# Altium project DAQ_REV_B2.PrjPcb (part 1 of 2)
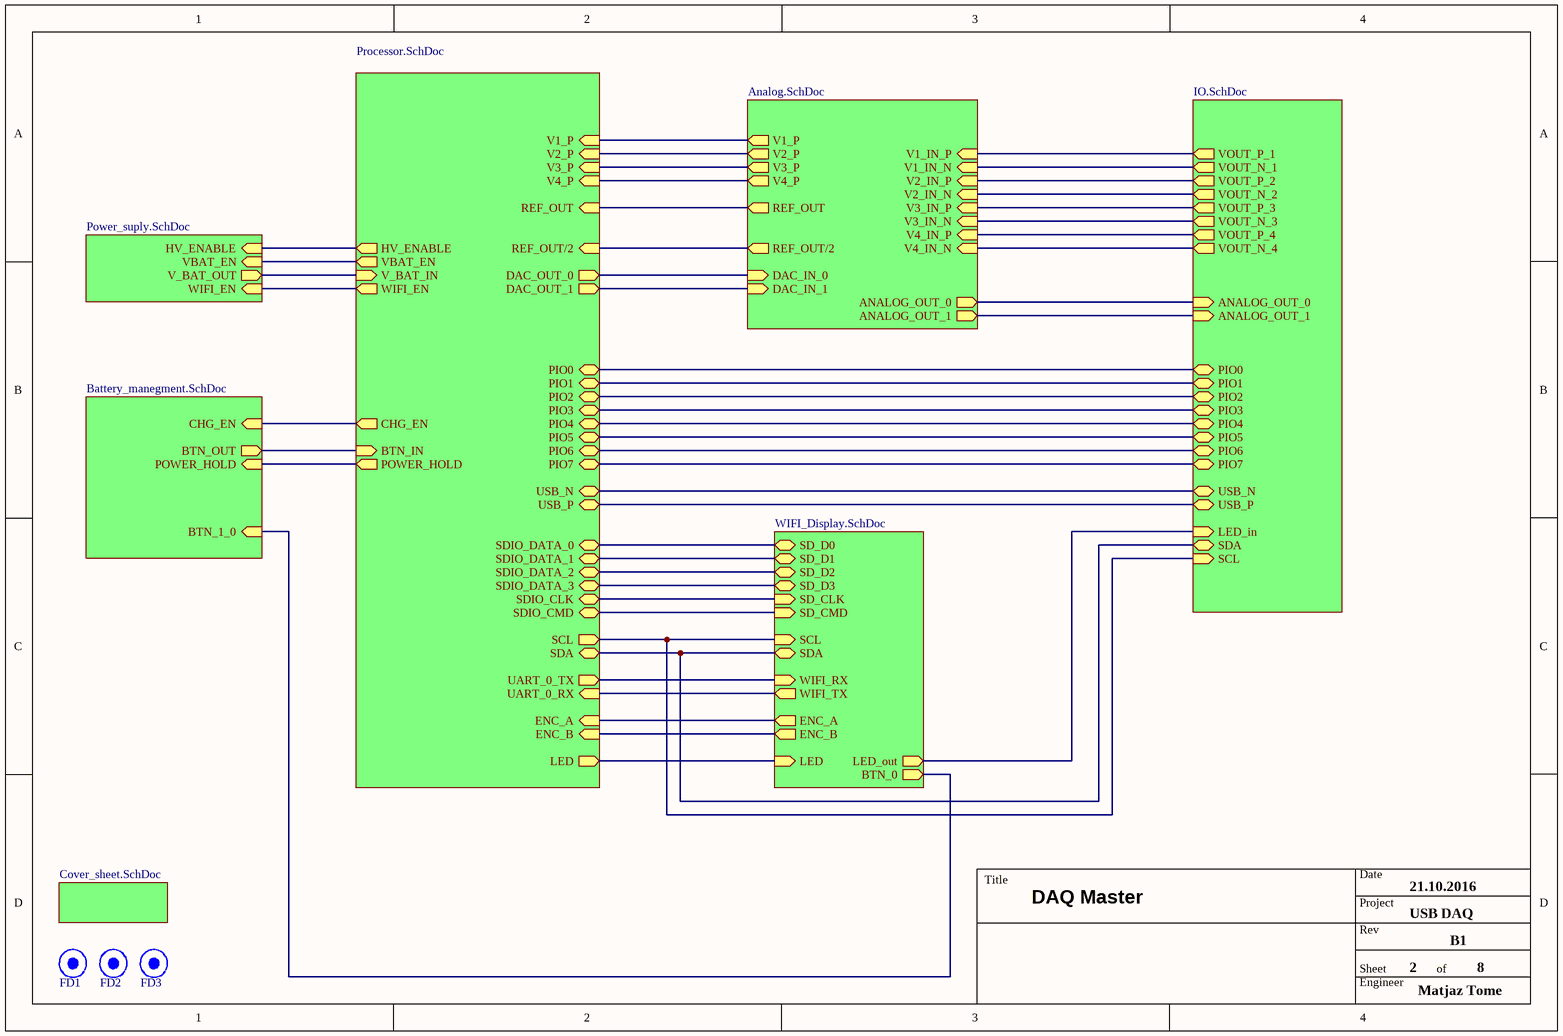
[diagram p0: DAQ.SchDoc]
ProjectEngineer: Matjaz Tome; ProjectName: DAQ; ProjectRev: B
8 sheets, 191 parts. Net scope: hierarchical (ports join the sheet entries above them; power ports are global).
Board file: DAQ_REV_B2.PcbDoc
Sheets:
  DAQ.SchDoc
     = Processor.SchDoc
     = Analog.SchDoc
     = IO.SchDoc
     = Power_suply.SchDoc
     = Battery_manegment.SchDoc
     = WIFI_Display.SchDoc
     = Cover_sheet.SchDoc

## Sheet DAQ.SchDoc: DAQ Master
size A4; Date: 21.10.2016; Engineer: Matjaz Tome; DocumentNumber: 2; Revision: B1; SheetNumber: 2; SheetTotal: 8; Project: USB DAQ

### Parts
FD1  Fiducial 1mm  [FID1]  (value not drawn)  (no BOM)
FD2  Fiducial 1mm  [FID1]  (value not drawn)  (no BOM)
FD3  Fiducial 1mm  [FID1]  (value not drawn)  (no BOM)

### Sub-sheets
? = Processor.SchDoc: PIO0 (bidir), PIO1 (bidir), PIO2 (bidir), PIO3 (bidir), PIO4 (bidir), PIO5 (bidir), PIO6 (bidir), PIO7 (bidir), V3_P (in), V4_P (in), V1_P (in), V2_P (in), USB_N (bidir), USB_P (bidir), DAC_OUT_0 (out), DAC_OUT_1 (out), REF_OUT/2 (in), REF_OUT (in), HV_ENABLE (out), SDIO_DATA_0 (bidir), SDIO_DATA_1 (bidir), SDIO_DATA_2 (bidir), SDIO_DATA_3 (bidir), SDIO_CLK (bidir), SDIO_CMD (bidir), UART_0_TX (out), UART_0_RX (in), SCL (out), SDA (bidir), POWER_HOLD (out), V_BAT_IN (in), ENC_A (in), ENC_B (in), WIFI_EN (out), VBAT_EN (out), BTN_IN (in), LED (out), CHG_EN (out)
? = Analog.SchDoc: V1_IN_P (in), V1_IN_N (in), V2_IN_N (in), V3_IN_N (in), V4_IN_N (in), V4_IN_P (in), V3_IN_P (in), V2_IN_P (in), REF_OUT/2 (out), DAC_IN_0 (in), DAC_IN_1 (in), ANALOG_OUT_0 (out), ANALOG_OUT_1 (out), V1_P (out), V2_P (out), V3_P (out), V4_P (out), REF_OUT (out)
? = IO.SchDoc: PIO0 (bidir), PIO1 (bidir), PIO2 (bidir), PIO3 (bidir), PIO4 (bidir), PIO5 (bidir), PIO6 (bidir), PIO7 (bidir), VOUT_N_1 (out), VOUT_N_2 (out), VOUT_N_3 (out), VOUT_N_4 (out), VOUT_P_1 (out), VOUT_P_2 (out), VOUT_P_3 (out), VOUT_P_4 (out), ANALOG_OUT_0 (in), ANALOG_OUT_1 (in), USB_N (bidir), USB_P (bidir), SDA (bidir), SCL (in), LED_in (in)
? = Power_suply.SchDoc: HV_ENABLE (in), VBAT_EN (in), V_BAT_OUT (out), WIFI_EN (in)
? = Battery_manegment.SchDoc: BTN_OUT (out), POWER_HOLD (in), BTN_1_0 (in), CHG_EN (in)
? = WIFI_Display.SchDoc: SD_CLK (in), ENC_B (out), BTN_0 (out), WIFI_RX (in), ENC_A (out), SD_D2 (bidir), SD_D3 (bidir), SDA (bidir), SCL (in), SD_D1 (bidir), WIFI_TX (out), SD_D0 (bidir), SD_CMD (in), LED (in), LED_out (out)
? = Cover_sheet.SchDoc: no entries

### Nets
ANALOG_OUT_0: sheet /ANALOG_OUT_0, sheet /ANALOG_OUT_0
ANALOG_OUT_1: sheet /ANALOG_OUT_1, sheet /ANALOG_OUT_1
BTN_0: sheet /BTN_1_0, sheet /BTN_0
BTN_IN: sheet /BTN_IN, sheet /BTN_OUT
CHG_EN: sheet /CHG_EN, sheet /CHG_EN
DAC_OUT_0: sheet /DAC_OUT_0, sheet /DAC_IN_0
DAC_OUT_1: sheet /DAC_OUT_1, sheet /DAC_IN_1
ENC_A: sheet /ENC_A, sheet /ENC_A
ENC_B: sheet /ENC_B, sheet /ENC_B
HV_ENABLE: sheet /HV_ENABLE, sheet /HV_ENABLE
JTAG_TDO: sheet /LED, sheet /LED
LED_in: sheet /LED_in, sheet /LED_out
PIO0: sheet /PIO0, sheet /PIO0
PIO1: sheet /PIO1, sheet /PIO1
PIO2: sheet /PIO2, sheet /PIO2
PIO3: sheet /PIO3, sheet /PIO3
PIO4: sheet /PIO4, sheet /PIO4
PIO5: sheet /PIO5, sheet /PIO5
PIO6: sheet /PIO6, sheet /PIO6
PIO7: sheet /PIO7, sheet /PIO7
POWER_HOLD: sheet /POWER_HOLD, sheet /POWER_HOLD
REF_OUT: sheet /REF_OUT, sheet /REF_OUT
REF_OUT/2: sheet /REF_OUT/2, sheet /REF_OUT/2
SCL: sheet /SCL, sheet /SCL, sheet /SCL
SD_CLK: sheet /SDIO_CLK, sheet /SD_CLK
SD_CMD: sheet /SDIO_CMD, sheet /SD_CMD
SD_D0: sheet /SDIO_DATA_0, sheet /SD_D0
SD_D1: sheet /SDIO_DATA_1, sheet /SD_D1
SD_D2: sheet /SDIO_DATA_2, sheet /SD_D2
SD_D3: sheet /SDIO_DATA_3, sheet /SD_D3
SDA: sheet /SDA, sheet /SDA, sheet /SDA
UART_0_RX: sheet /UART_0_RX, sheet /WIFI_TX
UART_0_TX: sheet /UART_0_TX, sheet /WIFI_RX
USB_N: sheet /USB_N, sheet /USB_N
USB_P: sheet /USB_P, sheet /USB_P
V1_IN_N: sheet /V1_IN_N, sheet /VOUT_N_1
V1_IN_P: sheet /V1_IN_P, sheet /VOUT_P_1
V1_P: sheet /V1_P, sheet /V1_P
V2_IN_N: sheet /V2_IN_N, sheet /VOUT_N_2
V2_IN_P: sheet /V2_IN_P, sheet /VOUT_P_2
V2_P: sheet /V2_P, sheet /V2_P
V3_IN_N: sheet /V3_IN_N, sheet /VOUT_N_3
V3_IN_P: sheet /V3_IN_P, sheet /VOUT_P_3
V3_P: sheet /V3_P, sheet /V3_P
V4_IN_N: sheet /V4_IN_N, sheet /VOUT_N_4
V4_IN_P: sheet /V4_IN_P, sheet /VOUT_P_4
V4_P: sheet /V4_P, sheet /V4_P
V_BAT_IN: sheet /V_BAT_IN, sheet /V_BAT_OUT
VBAT_EN: sheet /VBAT_EN, sheet /VBAT_EN
WIFI_EN: sheet /WIFI_EN, sheet /WIFI_EN

### Notes on the sheet
- Title
- Date
- Project
- Rev
- Engineer
- Sheet
- of

### Library data of the parts
FD1-FD3 = XXC0016: Part Number: XXC0016; Category: Fiducials

## Sheet Processor.SchDoc: Processor + JTAG
size A4; Date: 23.10.2016; Engineer: Matjaz Tome; DocumentNumber: 5; Revision: B1; SheetNumber: 5; SheetTotal: 8; Project: USB DAQ
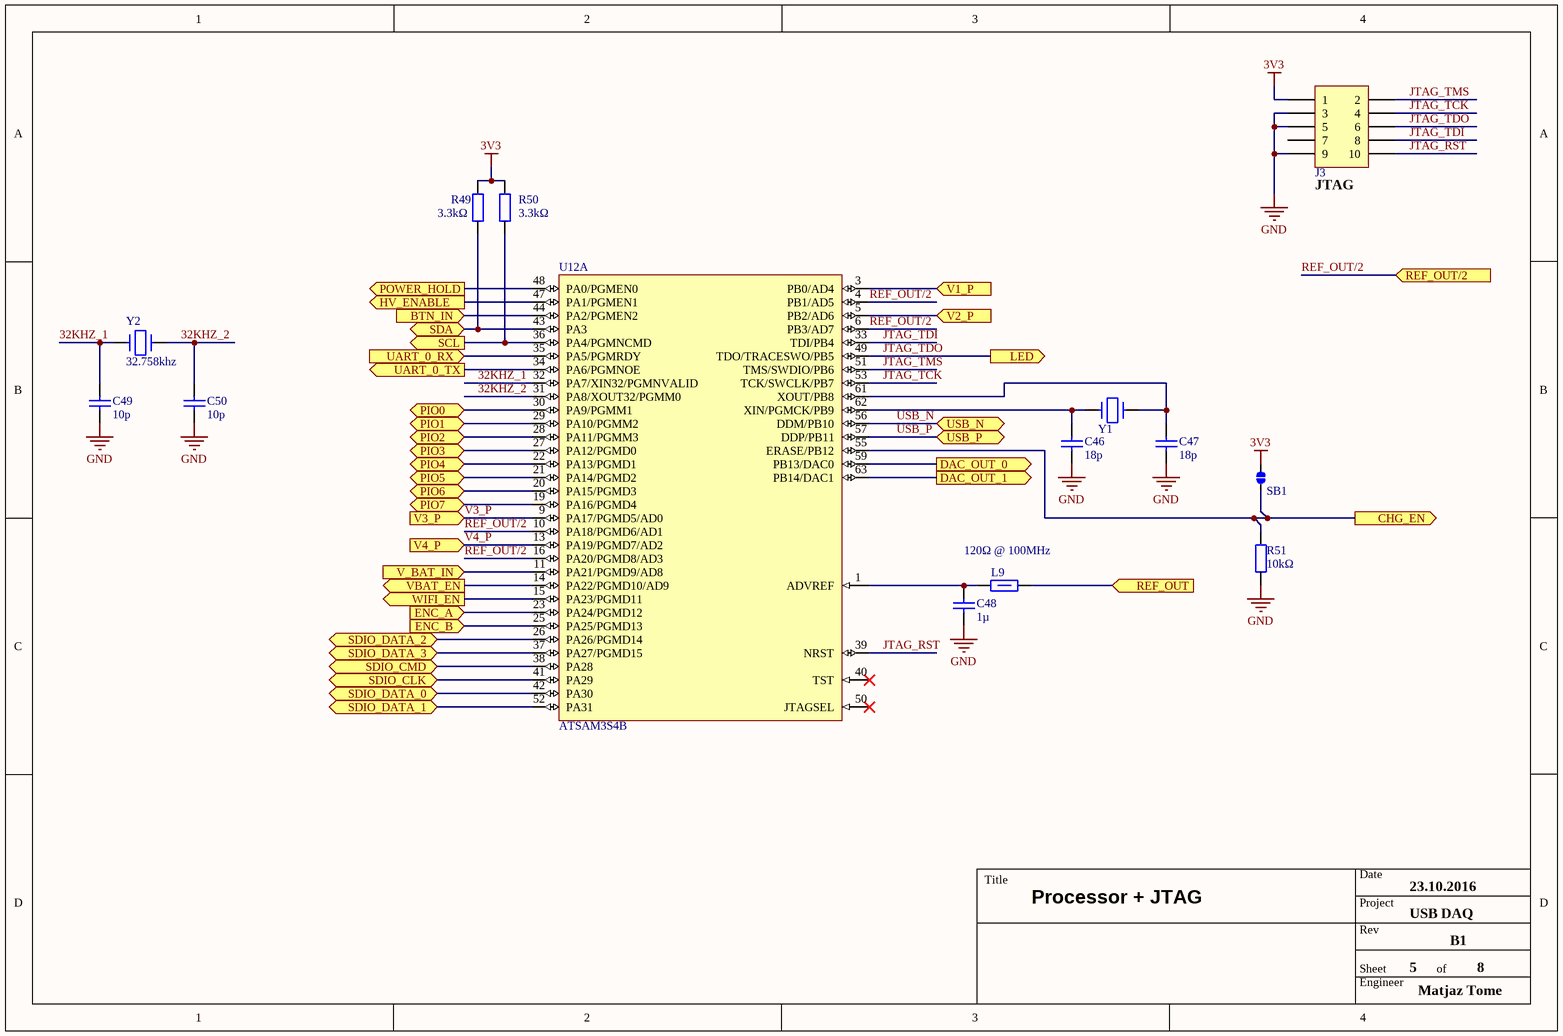
[diagram p1: Processor.SchDoc]

### Parts
C46  18p  [0603C]
C47  18p  [0603C]
C48  1µ  [0603C]
C49  10p  [0603C]
C50  10p  [0603C]
J3  (no value)  [HEADER_2X05_1.27mm]
L9  120Ω @ 100MHz  [0805R]
R49  3.3kΩ  [0603R]
R50  3.3kΩ  [0603R]
R51  10kΩ  [0603R]
SB1  Solder bridge  [SB1]  (value not drawn)  (no BOM)
U12  ATSAM3S4B  [LQFP64]  (part A of 2)
Y1  16MHz  [5X3.2]  (value not drawn)
Y2  32.758khz  [2X6_FLAT]

### Ports
BTN_IN (in), CHG_EN (out), DAC_OUT_0 (out), DAC_OUT_1 (out), ENC_A (in), ENC_B (in), HV_ENABLE (out), LED (out), PIO0 (bidir), PIO1 (bidir), PIO2 (bidir), PIO3 (bidir), PIO4 (bidir), PIO5 (bidir), PIO6 (bidir), PIO7 (bidir), POWER_HOLD (out), REF_OUT (in), REF_OUT/2 (in), SCL (out), SDA (bidir), SDIO_CLK (bidir), SDIO_CMD (bidir), SDIO_DATA_0 (bidir), SDIO_DATA_1 (bidir), SDIO_DATA_2 (bidir), SDIO_DATA_3 (bidir), UART_0_RX (in), UART_0_TX (out), USB_N (bidir), USB_P (bidir), V1_P (in), V2_P (in), V3_P (in), V4_P (in), V_BAT_IN (in), VBAT_EN (out), WIFI_EN (out)

### Nets
3V3: J3.1 R49.2 R50.2 SB1.2
GND: C46.1 C47.1 C48.1 C49.1 C50.1 J3.3 J3.5 J3.9 R51.1
32KHZ_1: C49.2 U12.32(PA7/XIN32/PGMNVALID) Y2.2
32KHZ_2: C50.2 U12.31(PA8/XOUT32/PGMM0) Y2.1
BTN_IN: U12.44(PA2/PGMEN2) ; port BTN_IN
CHG_EN: R51.2 SB1.1 U12.55(ERASE/PB12) ; port CHG_EN
DAC_OUT_0: U12.59(PB13/DAC0) ; port DAC_OUT_0
DAC_OUT_1: U12.63(PB14/DAC1) ; port DAC_OUT_1
ENC_A: U12.23(PA24/PGMD12) ; port ENC_A
ENC_B: U12.25(PA25/PGMD13) ; port ENC_B
HV_ENABLE: U12.47(PA1/PGMEN1) ; port HV_ENABLE
JTAG_RST: J3.10 U12.39(NRST)
JTAG_TCK: J3.4 U12.53(TCK/SWCLK/PB7)
JTAG_TDI: J3.8 U12.33(TDI/PB4)
JTAG_TDO: J3.6 U12.49(TDO/TRACESWO/PB5) ; port LED
JTAG_TMS: J3.2 U12.51(TMS/SWDIO/PB6)
PIO0: U12.30(PA9/PGMM1) ; port PIO0
PIO1: U12.29(PA10/PGMM2) ; port PIO1
PIO2: U12.28(PA11/PGMM3) ; port PIO2
PIO3: U12.27(PA12/PGMD0) ; port PIO3
PIO4: U12.22(PA13/PGMD1) ; port PIO4
PIO5: U12.21(PA14/PGMD2) ; port PIO5
PIO6: U12.20(PA15/PGMD3) ; port PIO6
PIO7: U12.19(PA16/PGMD4) ; port PIO7
POWER_HOLD: U12.48(PA0/PGMEN0) ; port POWER_HOLD
REF_OUT: L9.2 ; port REF_OUT
REF_OUT/2: U12.4(PB1/AD5) U12.6(PB3/AD7) U12.10(PA18/PGMD6/AD1) U12.16(PA20/PGMD8/AD3) ; port REF_OUT/2
SCL: R50.1 U12.36(PA4/PGMNCMD) ; port SCL
SD_CLK: U12.41(PA29) ; port SDIO_CLK
SD_CMD: U12.38(PA28) ; port SDIO_CMD
SD_D0: U12.42(PA30) ; port SDIO_DATA_0
SD_D1: U12.52(PA31) ; port SDIO_DATA_1
SD_D2: U12.26(PA26/PGMD14) ; port SDIO_DATA_2
SD_D3: U12.37(PA27/PGMD15) ; port SDIO_DATA_3
SDA: R49.1 U12.43(PA3) ; port SDA
UART_0_RX: U12.35(PA5/PGMRDY) ; port UART_0_RX
UART_0_TX: U12.34(PA6/PGMNOE) ; port UART_0_TX
USB_N: U12.56(DDM/PB10) ; port USB_N
USB_P: U12.57(DDP/PB11) ; port USB_P
V1_P: U12.3(PB0/AD4) ; port V1_P
V2_P: U12.5(PB2/AD6) ; port V2_P
V3_P: U12.9(PA17/PGMD5/AD0) ; port V3_P
V4_P: U12.13(PA19/PGMD7/AD2) ; port V4_P
V_BAT_IN: U12.11(PA21/PGMD9/AD8) ; port V_BAT_IN
VBAT_EN: U12.14(PA22/PGMD10/AD9) ; port VBAT_EN
WIFI_EN: U12.15(PA23/PGMD11) ; port WIFI_EN
NetC46_2: C46.2 U12.62(XIN/PGMCK/PB9) Y1.1
NetC47_2: C47.2 U12.61(XOUT/PB8) Y1.2
NetC48_2: C48.2 L9.1 U12.1(ADVREF)

Not connected (* = marked no-connect by the designer): J3 7; U12 40(TST)* 50(JTAGSEL)*

### Notes on the sheet
- (near J3) JTAG
- Title
- Date
- Project
- Rev
- Engineer
- Sheet
- of

### Library data of the parts
C46 C47 = GSC0017: ceramic C0G SMD capacitor smd 0603 18pF 100V; Manufacturer: Kemet; Manufacturer Number: C0603C180J1GACTU; Dealer number: 1813428; Dealer: Farnell; Tolerance: 5%; Part Number: GSC0017; Category: capacitors; Price: 0.15; Value: 18pF; Voltage: 100V; Case: 0603; Technology: SMT; Dielectric: C0G; HelpURL: U:\datasheet\cap\KEMET C0G SMD.pdf; SKU: 1020000000003; Supplier 1: Farnell; Supplier part number 1: 1813428
C48 = ZSC0003: ceramic X5R SMD capacitor smd 0603 1µF 50V; Manufacturer: Murata; Manufacturer Number: GRM188R61H105KAALD; Tolerance: 10%; Part Number: ZSC0003; Category: capacitors; Price: 0.144; Value: 1µF; Voltage: 50V; Case: 0603; Technology: SMT; Dielectric: X5R; HelpURL: U:\datasheet\cap\Murata\GRM\GRM188R61H105KAALD.pdf; SKU: 1020300000001; Supplier part number 1: 1845736; Supplier 1: Farnell
C49 C50 = GSC0019: ceramic C0G SMD capacitor smd 0603 10pF 100V; Manufacturer: Kemet; Manufacturer Number: C0603C100J1GACTU; Dealer number: 1414600; Dealer: Farnell; Tolerance: 5%; Part Number: GSC0019; Category: capacitors; Price: 0.038; Value: 10pF; Voltage: 100V; Case: 0603; Technology: SMT; Dielectric: C0G; HelpURL: U:\datasheet\cap\KEMET C0G SMD.pdf; SKU: 1020000000004; Supplier 1: Farnell; Supplier part number 1: 1414600
J3 = XCH0006: Header strait 1.27mm 5way X 2; Manufacturer: Harwin; Manufacturer Number: M50-3600542; Gender: Male; Rows: 2; Part Number: XCH0006; Category: Connectors; Price: 0.90; Pins: 5; Pitch: 1.27mm; Orientation: strait; Technology: SMD; Supplier part number 1: 1022310; Supplier 1: Farnell
L9 = XFB0000: Ferrite bead, 0.15Ω, 200mA, 0805, 120E @ 100MHz; Manufacturer: Murata; Manufacturer Number: BLM21AG121SN1D; Dealer number: 1515617; Dealer: Farnell; Max current: 0.2A; Part Number: XFB0000; Category: ferite beads; Price: 0.082; DC resistance: 0.15Ω; AC resistance: 120Ω; Frequency: 100MHz; Case: 0805; Technology: SMT; HelpURL: U:\datasheet\ferrite_beads\BLM21A.pdf; Supplier 1: Farnell; Supplier part number 1: 1515617
R49 R50 = XRS0055: resistor smd 0603 3.3kΩ 5% 0.1w; Manufacturer: Yageo; Manufacturer Number: RC0603JR-073K3L; Temperature coefficient: 100ppm; Part Number: XRS0055; Category: resistors; Supplier part number 1: 9233440; Supplier 1: Farnell; Price: 0.0118; Value: 3.3kΩ; Power: 0.1W; Tolerance: 5%; Case: 0603; Technology: SMT; Material: Metal film / Metal film; HelpURL: U:\datasheet\res\YAGEO_2.pdf
R51 = YRS0016: resistor smd 0603 10kΩ 1% 0.1w; Manufacturer: Vishay; Manufacturer Number: CRCW060310K0FKEA; Dealer number: 1469748; Dealer: Farnell; Temperature coefficient: 100ppm; Part Number: YRS0016; Category: resistors; Price: 0.0143€; Value: 10kΩ; Power: 0.1W; Tolerance: 1%; Case: 0603; Technology: SMT; Material: Metal film - thick / Metal film; HelpURL: U:\datasheet\res\VISHAY CRCW0603.pdf; SKU: 1000000000002; Supplier 1: Farnell; Supplier part number 1: 1469748
SB1 = XXC0005: Solder bridge 1mm by 2mm; Part Number: XXC0005; Category: Solder bridge
U12 = XAM0003: Cortex M3 ARM microcontroller; Manufacturer: Atmel; Manufacturer Number: ATSAM3S4BA-AU; Dealer number: 1841656; Dealer: Farnell; Core: Cortex-M3; Supply voltage max: 3.6V; Supply voltage min: 1.62V; Flash: 256kB; RAM: 48kB; GPIOs: 47; Timers: 3; ADCs: 8; SPI: 1; IIC: 2; Max Frequency: 64MHz; Part Number: XAM0003; Category: Integrated circuits; Price: 6.58; UART: 3; Case: LQFP64; Technology: SMT; HelpURL: U:\datasheet\microcontrollers\arm\SAM3SXA.pdf; Temperature range: -40°C to +85°C; Supplier 1: Farnell; Supplier part number 1: 1841656
Y1 = XCR0007: Crystal 16Mhz; Manufacturer: TCX; Manufacturer Number: 7A-16.000MAAJ-T; Load capacitance: 18pF; Frequency tolerance: 30ppm; Part Number: XCR0007; Category: Crystals; Price: 0.91; Value: 16MHz; Technology: SMT; Case: 5X3.2; HelpURL: U:\datasheet\crystals\TXC_7A.pdf; Supplier part number 1: 1841946; Supplier 1: Farnell
Y2 = XCR0010: Crystal 32.768khz; Manufacturer: RALTRON; Manufacturer Number: R26-32.768- 12.5; Load capacitance: 12pF; Frequency tolerance: 20ppm; Part Number: XCR0010; Category: Crystals; Price: 0.18; Value: 32.758khz; Technology: THT; Case: 5X3.2_1; HelpURL: U:\datasheet\crystals\raltron.pdf; Supplier part number 1: 1652573; Supplier 1: Farnell

## Sheet Analog.SchDoc: Level shifters + Amplifiers
size A4; Date: 6.4.2015; Engineer: Matjaz Tome; DocumentNumber: 6; Revision: B1; SheetNumber: 6; SheetTotal: 8; Project: USB DAQ
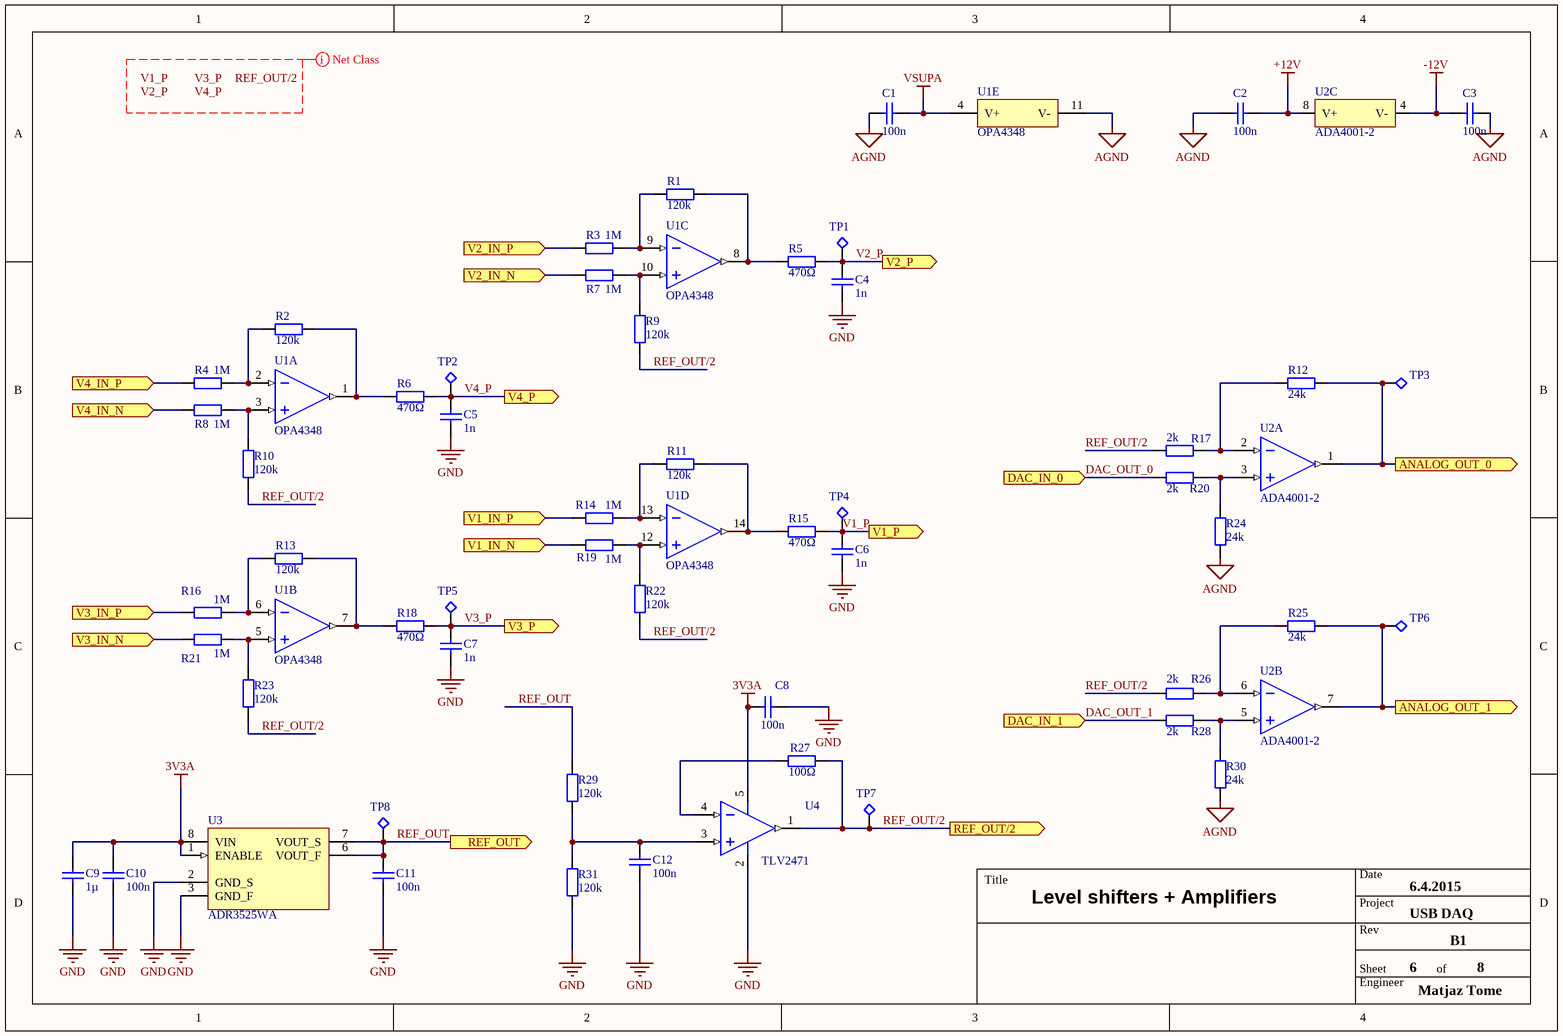
[diagram p2: Analog.SchDoc]

### Parts
C1  100n  [0603C]
C2  100n  [0603C]
C3  100n  [0603C]
C4  1n  [0603C]
C5  1n  [0603C]
C6  1n  [0603C]
C7  1n  [0603C]
C8  100n  [0603C]
C9  1µ  [0603C]
C10  100n  [0603C]
C11  100n  [0603C]
C12  100n  [0603C]
R1  120k  [0603R]
R2  120k  [0603R]
R3  1M  [0603R]
R4  1M  [0603R]
R5  470Ω  [0603R]
R6  470Ω  [0603R]
R7  1M  [0603R]
R8  1M  [0603R]
R9  120k  [0603R]
R10  120k  [0603R]
R11  120k  [0603R]
R12  24k  [0603R]
R13  120k  [0603R]
R14  1M  [0603R]
R15  470Ω  [0603R]
R16  1M  [0603R]
R17  2k  [0603R]
R18  470Ω  [0603R]
R19  1M  [0603R]
R20  2k  [0603R]
R21  1M  [0603R]
R22  120k  [0603R]
R23  120k  [0603R]
R24  24k  [0603R]
R25  24k  [0603R]
R26  2k  [0603R]
R27  100Ω  [0603R]
R28  2k  [0603R]
R29  120k  [0603R]
R30  24k  [0603R]
R31  120k  [0603R]
TP1  testpoint  [TP1_FULL]  (value not drawn)  (no BOM)
TP2  testpoint  [TP1_FULL]  (value not drawn)  (no BOM)
TP3  testpoint  [TP1_FULL]  (value not drawn)  (no BOM)
TP4  testpoint  [TP1_FULL]  (value not drawn)  (no BOM)
TP5  testpoint  [TP1_FULL]  (value not drawn)  (no BOM)
TP6  testpoint  [TP1_FULL]  (value not drawn)  (no BOM)
TP7  testpoint  [TP1_FULL]  (value not drawn)  (no BOM)
TP8  testpoint  [TP1_FULL]  (value not drawn)  (no BOM)
U1  OPA4348  [SOIC14]  (parts A,B,C,D,E of 5)
U2  ADA4001-2  [SOIC8]  (parts A,B,C of 3)
U3  ADR3525WA  [MSOP8]
U4  TLV2471  [SOT23-5]

### Ports
ANALOG_OUT_0 (out), ANALOG_OUT_1 (out), DAC_IN_0 (in), DAC_IN_1 (in), REF_OUT (out), REF_OUT/2 (out), V1_IN_N (in), V1_IN_P (in), V1_P (out), V2_IN_N (in), V2_IN_P (in), V2_P (out), V3_IN_N (in), V3_IN_P (in), V3_P (out), V4_IN_N (in), V4_IN_P (in), V4_P (out)

### Nets
3V3A: C8.2 C9.2 C10.2 U3.1(ENABLE) U3.8(VIN) U4.5(V+)
+12V: C2.1 U2.8(V+)
-12V: C3.2 U2.4(V-)
AGND: C1.2 C2.2 C3.1 R24.1 R30.1 U1.11(V-)
GND: C4.1 C5.1 C6.1 C7.1 C8.1 C9.1 C10.1 C11.1 C12.1 R31.1 U3.2(GND_S) U3.3(GND_F) U4.2(V-)
VSUPA: C1.1 U1.4(V+)
ANALOG_OUT_0: R12.2 TP3.1 U2.1(OUT) ; port ANALOG_OUT_0
ANALOG_OUT_1: R25.1 TP6.1 U2.7(OUT) ; port ANALOG_OUT_1
DAC_OUT_0: R20.1 ; port DAC_IN_0
DAC_OUT_1: R28.1 ; port DAC_IN_1
REF_OUT: C11.2 R29.2 TP8.1 U3.6(VOUT_F) U3.7(VOUT_S) ; port REF_OUT
REF_OUT/2: R9.1 R10.1 R17.1 R22.1 R23.1 R26.1 R27.2 TP7.1 U4.1(OUT_A) ; port REF_OUT/2
V1_IN_N: R19.1 ; port V1_IN_N
V1_IN_P: R14.1 ; port V1_IN_P
V1_P: C6.2 R15.2 TP4.1 ; port V1_P
V2_IN_N: R7.1 ; port V2_IN_N
V2_IN_P: R3.1 ; port V2_IN_P
V2_P: C4.2 R5.2 TP1.1 ; port V2_P
V3_IN_N: R21.1 ; port V3_IN_N
V3_IN_P: R16.1 ; port V3_IN_P
V3_P: C7.2 R18.2 TP5.1 ; port V3_P
V4_IN_N: R8.1 ; port V4_IN_N
V4_IN_P: R4.1 ; port V4_IN_P
V4_P: C5.2 R6.2 TP2.1 ; port V4_P
NetC12_2: C12.2 R29.1 R31.2 U4.3(+IN_A)
NetR1_1: R1.1 R3.2 U1.9(-IN_C)
NetR1_2: R1.2 R5.1 U1.8(OUT_C)
NetR2_1: R2.1 R4.2 U1.2(-IN_A)
NetR2_2: R2.2 R6.1 U1.1(OUT_A)
NetR7_2: R7.2 R9.2 U1.10(+IN_C)
NetR8_2: R8.2 R10.2 U1.3(+IN_A)
NetR11_1: R11.1 R14.2 U1.13(-IN_D)
NetR11_2: R11.2 R15.1 U1.14(OUT_D)
NetR12_1: R12.1 R17.2 U2.2(IN-)
NetR13_1: R13.1 R16.2 U1.6(-IN_B)
NetR13_2: R13.2 R18.1 U1.7(OUT_B)
NetR19_2: R19.2 R22.2 U1.12(+IN_D)
NetR20_2: R20.2 R24.2 U2.3(IN+)
NetR21_2: R21.2 R23.2 U1.5(+IN_B)
NetR25_2: R25.2 R26.2 U2.6(IN2-)
NetR27_1: R27.1 U4.4(-IN_A)
NetR28_2: R28.2 R30.2 U2.5(IN2+)

### Layout directives
net class ANALOG: REF_OUT/2, V1_P, V2_P, V3_P, V4_P

### Notes on the sheet
- Labels drawn without touching a wire or pin: REF_OUT/2, V1_P, V2_P, V3_P, V4_P
- Title
- Date
- Project
- Rev
- Engineer
- Sheet
- of

### Library data of the parts
C1-C3 C8 C10-C12 = RSC0013: ceramic X7R SMD capacitor smd 0603 100nF 16V; Manufacturer: Murata; Manufacturer Number: GRM188R71C104KA01D; Dealer number: 1828890; Dealer: Farnell; Tolerance: 10%; Part Number: RSC0013; Category: capacitors; Price: 0.042; Value: 100nF; Voltage: 16V; Case: 0603; Technology: SMT; Dielectric: X7R; HelpURL: U:\datasheet\cap\Murata\GRM\GRM188R71C104KA01D.pdf; Supplier 1: Farnell; Supplier Part Number 1: 1828890
C4-C7 = RSC0016: ceramic X7R SMD capacitor smd 0603 1nF 100V; Manufacturer: Kemet; Manufacturer Number: C0603C102K1RACTU; Dealer number: 1414606; Dealer: Farnell; Tolerance: 10%; Part Number: RSC0016; Category: capacitors; Price: 0.039; Value: 1nF; Voltage: 100V; Case: 0603; Technology: SMT; Dielectric: X7R; HelpURL: U:\datasheet\cap\KEMET X7R SMD.pdf; Supplier 1: Farnell; Supplier Part Number 1: 1414606; SKU: 1020100000013
C9 = ZSC0003: as C48 on sheet Processor; Part Number: ZSC0003; Category: capacitors; Price: 0.144; Value: 1µF; Voltage: 50V; Case: 0603; Technology: SMT; Dielectric: X5R; HelpURL: U:\datasheet\cap\Murata\GRM\GRM188R61H105KAALD.pdf; SKU: 1020300000001; Supplier part number 1: 1845736; Supplier 1: Farnell
R1 R2 R9-R11 R13 R22 R23 R29 R31 = ZRS0007: resistor smd 0603 120kΩ 0.1% 0.1w; Manufacturer: Panasonic; Manufacturer Number: ERA3AEB124V; Temperature coefficient: 25ppm; Part Number: ZRS0007; Category: resistors; Price: 0.26; Value: 120KΩ; Power: 0.1W; Tolerance: 0.1%; Case: 0603; Technology: SMT; Material: Metal film - thin / Metal film; HelpURL: U:\datasheet\res\PANASONIC_ERA.pdf; Supplier part number 1: 1577634; Supplier 1: Farnell
R3 R4 R7 R8 R14 R16 R19 R21 = ZRS0005: resistor smd 0603 1MΩ 0.1% 0.1w; Manufacturer: TE Connectivity; Manufacturer Number: CPF0603B1M0E1; Temperature coefficient: 25ppm; Part Number: ZRS0005; Category: resistors; Price: 0.36; Value: 1MΩ; Power: 0.1W; Tolerance: 0.1%; Case: 0603; Technology: SMT; Material: Metal film - thin / Metal film; HelpURL: U:\datasheet\res\TE_CONNECTIVITY_CPF.pdf; Supplier part number 1: 2331023; Supplier 1: Farnell
R5 R6 R15 R18 = XRS0039: resistor smd 0603 470Ω 5% 0.1w; Manufacturer: Multicomp; Manufacturer Number: MCMR06X471 JTL; Temperature coefficient: 100ppm; Part Number: XRS0039; Category: resistors; Price: 0.009€; Value: 470Ω; Power: 0.1W; Tolerance: 5%; Case: 0603; Technology: SMT; Material: Metal film / Metal film; HelpURL: U:\datasheet\res\MULTICOMP 0603.pdf; Supplier part number 1: 2073513; Supplier 1: Farnell
R12 R24 R25 R30 = ZRS0008: resistor smd 0603 24kΩ 0.1% 0.1w; Manufacturer: Welwyn; Manufacturer Number: PCF0603P-R-24K-BT1; Temperature coefficient: 25ppm; Part Number: ZRS0008; Category: resistors; Price: 0.194; Value: 24KΩ; Power: 0.1W; Tolerance: 0.1%; Case: 0603; Technology: SMT; Material: Metal film - thin / Metal film; HelpURL: U:\datasheet\res\WELW.pdf; Supplier part number 1: 1506034; Supplier 1: Farnell
R17 R20 R26 R28 = ZRS0001: resistor smd 0603 2kΩ 0.1% 0.1w; Manufacturer: Susumu; Manufacturer Number: RR0816P-202-B-T5; Temperature coefficient: 25ppm; Part Number: ZRS0001; Category: resistors; Price: 0.098; Value: 2KΩ; Power: 0.1W; Tolerance: 0.1%; Case: 0603; Technology: SMT; Material: Metal film - thin / Metal film; HelpURL: U:\datasheet\res\SUSUMU_RR.pdf; Supplier part number 1: 1653263; Supplier 1: Farnell
R27 = XRS0016: resistor smd 0603 100Ω 5% 0.1w; Manufacturer: Multicomp; Manufacturer Number: MCMR06X101 JTL; Temperature coefficient: 100ppm; Part Number: XRS0016; Category: resistors; Price: 0.009€; Value: 100Ω; Power: 0.1W; Tolerance: 5%; Case: 0603; Technology: SMT; Material: Metal film / Metal film; HelpURL: U:\datasheet\res\MULTICOMP 0603.pdf; Supplier part number 1: 2073352; Supplier 1: Farnell
TP1-TP8 = XXC0006: testpoint 1.5mm diameter no hole; Part Number: XXC0006; Category: testpoints
U1 = XOG0008: 1MHz, 45µA, CMOS, Rail-to-Rail OPERATIONAL AMPLIFIERS Value Line Series; Manufacturer: Texas Instruments; Manufacturer Number: OPA4348AID; Supply voltage max: 5.5V; Supply voltage min: 2.1V; Devices: 4; Rail to Rail: IN/OUT; Part Number: XOG0008; Category: Integrated circuits; Price: 1.64; GBP: 1MHz; Case: SOIC14; Technology: SMT; HelpURL: U:\datasheet\opamps\OPA348.pdf; Supplier part number 1: 2323277; Supplier 1: Farnell
U2 = XOG0003: Low Noise, Low Input Bias Current, Rail-to-Rail / Output, JFET Dual Operational Amplifier; Manufacturer: Analog devices; Manufacturer Number: ADA4001-2ARZ; Supply voltage max: 36V; Devices: 2; GBP: 16.7MHz; Slew rate: 25V/µs; Rail to Rail: IN/OUT; Part Number: XOG0003; Category: Integrated circuits; Price: 2.8; Case: SOIC8; Technology: SMT; HelpURL: U:\datasheet\opamps\ADA4001-2.pdf; Supplier part number 1: 2081044; Supplier 1: Farnell
U3 = VRX0002: Micropower, High Accuracy / Voltage References; Manufacturer: Analog devices; Manufacturer Number: ADR3525WARMZ-R7; Dealer number: 2077701; Dealer: Farnell; Output Voltage: 2.5V; Max input voltage: 5.5V; Output current: 10mA; Voltage tolerance: 0.1%; Part Number: VRX0002; Category: Integrated circuits; Price: 1.66; Case: MSOP8; Technology: SMT; HelpURL: U:\datasheet\volage_references\ADR35XX.pdf; Supplier 1: Farnell; Supplier part number 1: 2077701
U4 = XOG0002: FAMILY OF 600μA/Ch 2.8MHz RAIL-TO-RAIL INPUT/OUTPUT / HIGH-DRIVE OPERATIONAL AMPLIFIERS WITH SHUTDOWN; Manufacturer: Texas Instruments; Manufacturer Number: TLV2471IDBVT; Supply voltage max: 6V; Supply voltage min: 2.7V; Devices: 1; Rail to Rail: IN/OUT; Part Number: XOG0002; Category: Integrated circuits; Price: 1.43; GBP: 2.8MHz; Case: SOT23-5; Technology: SMT; HelpURL: U:\datasheet\opamps\TLV247x.pdf; Supplier part number 1: 1102964; Supplier 1: Farnell

## Sheet IO.SchDoc: Digital I/O + ESD
size A4; Date: 23.10.2016; Engineer: Matjaz Tome; DocumentNumber: 8; Revision: B1; SheetNumber: 8; SheetTotal: 8; Project: USB DAQ
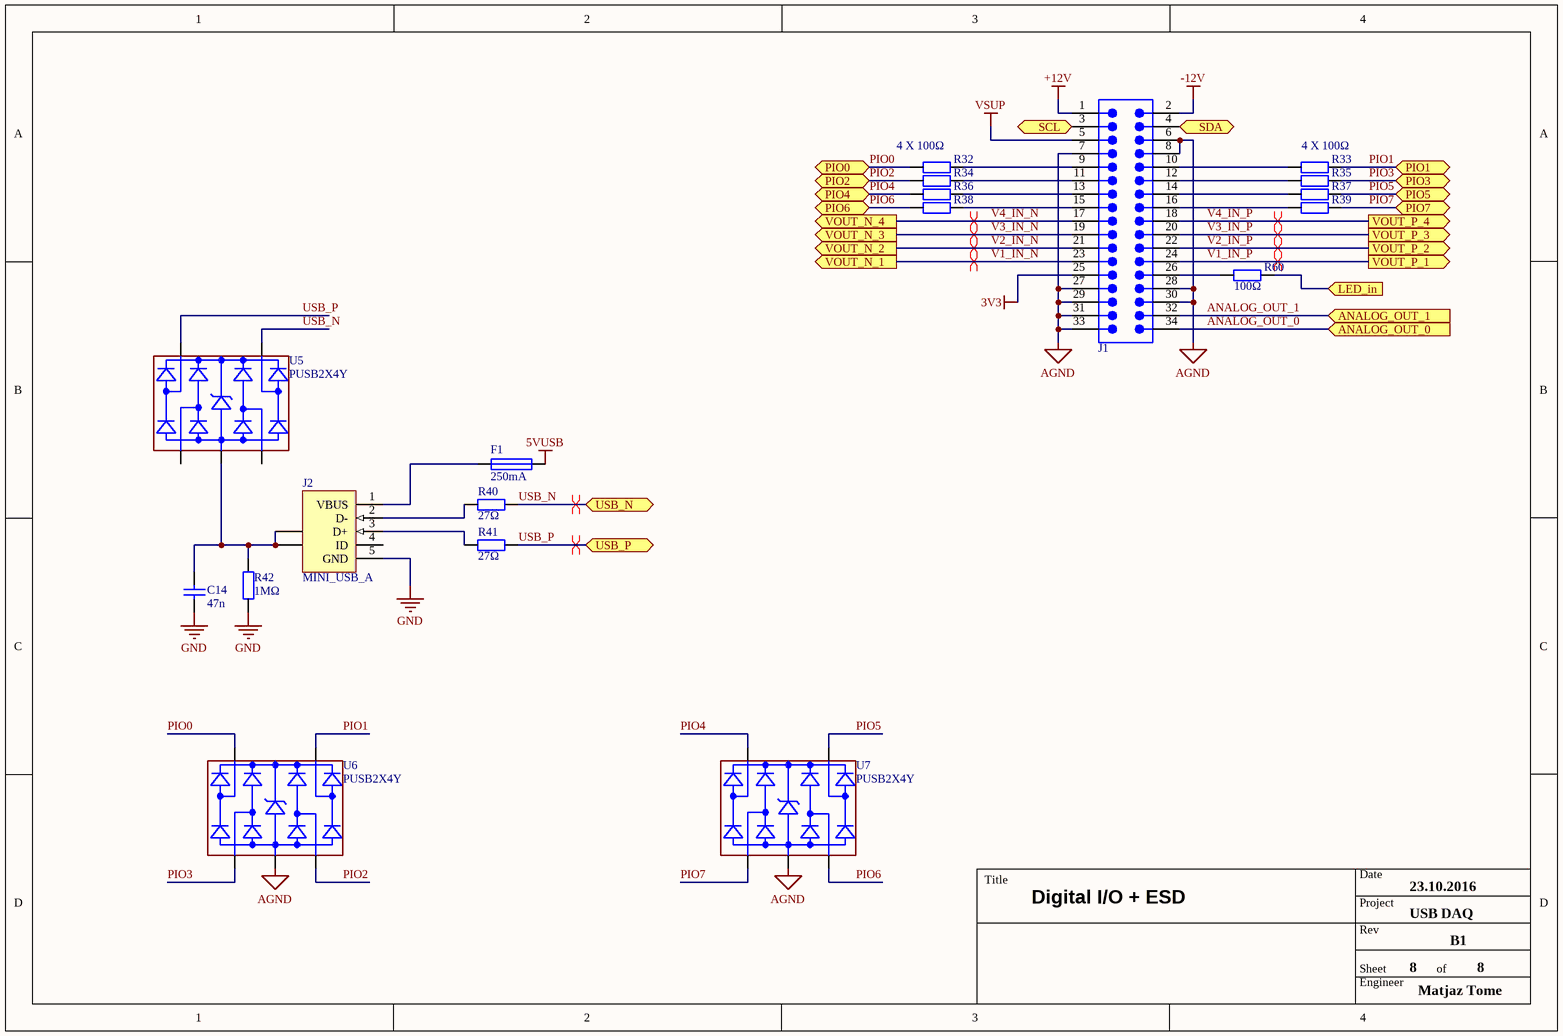
[diagram p3: IO.SchDoc]

### Parts
C14  47n  [0603C]
F1  250mA  [1206]
J1  IDC34R  [IDC34R]  (value not drawn)
J2  MINI_USB_A  [MICRO_USB_A]
R32  100Ω  [0603R]  (value not drawn)
R33  100Ω  [0603R]  (value not drawn)
R34  100Ω  [0603R]  (value not drawn)
R35  100Ω  [0603R]  (value not drawn)
R36  100Ω  [0603R]  (value not drawn)
R37  100Ω  [0603R]  (value not drawn)
R38  100Ω  [0603R]  (value not drawn)
R39  100Ω  [0603R]  (value not drawn)
R40  27Ω  [0603R]
R41  27Ω  [0603R]
R42  1MΩ  [0603R]
R60  100Ω  [0603R]
U5  PUSB2X4Y  [SOT363]
U6  PUSB2X4Y  [SOT363]
U7  PUSB2X4Y  [SOT363]

### Ports
ANALOG_OUT_0 (in), ANALOG_OUT_1 (in), LED_in (in), PIO0 (bidir), PIO1 (bidir), PIO2 (bidir), PIO3 (bidir), PIO4 (bidir), PIO5 (bidir), PIO6 (bidir), PIO7 (bidir), SCL (in), SDA (bidir), USB_N (bidir), USB_P (bidir), VOUT_N_1 (out), VOUT_N_2 (out), VOUT_N_3 (out), VOUT_N_4 (out), VOUT_P_1 (out), VOUT_P_2 (out), VOUT_P_3 (out), VOUT_P_4 (out)

### Nets
3V3: J1.25
5VUSB: F1.2
+12V: J1.1
-12V: J1.2
AGND: J1.6 J1.7 J1.8 J1.27 J1.28 J1.29 J1.30 J1.31 J1.33 U6.2 U7.2
GND: C14.1 J2.5(GND) R42.1
VSUP: J1.5
ANALOG_OUT_0: J1.34 ; port ANALOG_OUT_0
ANALOG_OUT_1: J1.32 ; port ANALOG_OUT_1
LED_in: R60.2 ; port LED_in
PIO0: R32.1 U6.6 ; port PIO0
PIO1: R33.2 U6.4 ; port PIO1
PIO2: R34.1 U6.3 ; port PIO2
PIO3: R35.2 U6.1 ; port PIO3
PIO4: R36.1 U7.6 ; port PIO4
PIO5: R37.2 U7.4 ; port PIO5
PIO6: R38.1 U7.3 ; port PIO6
PIO7: R39.2 U7.1 ; port PIO7
SCL: J1.3 ; port SCL
SDA: J1.4 ; port SDA
USB_N: R40.2 U5.4 ; port USB_N
USB_P: R41.2 U5.6 ; port USB_P
V1_IN_N: J1.23 ; port VOUT_N_1
V1_IN_P: J1.24 ; port VOUT_P_1
V2_IN_N: J1.21 ; port VOUT_N_2
V2_IN_P: J1.22 ; port VOUT_P_2
V3_IN_N: J1.19 ; port VOUT_N_3
V3_IN_P: J1.20 ; port VOUT_P_3
V4_IN_N: J1.17 ; port VOUT_N_4
V4_IN_P: J1.18 ; port VOUT_P_4
NetC14_2: C14.2 J2.6(SHLD) J2.7(SHLD) R42.2 U5.2
NetF1_1: F1.1 J2.1(VBUS)
NetJ1_9: J1.9 R32.2
NetJ1_10: J1.10 R33.1
NetJ1_11: J1.11 R34.2
NetJ1_12: J1.12 R35.1
NetJ1_13: J1.13 R36.2
NetJ1_14: J1.14 R37.1
NetJ1_15: J1.15 R38.2
NetJ1_16: J1.16 R39.1
NetJ1_26: J1.26 R60.1
NetJ2_2: J2.2(D-) R40.1
NetJ2_3: J2.3(D+) R41.1

Not connected (* = marked no-connect by the designer): J2 4(ID); U5 1 3

### Layout directives
differential pair: USB_N, USB_P, V1_IN_N, V1_IN_P, V2_IN_N, V2_IN_P, V3_IN_N, V3_IN_P, V4_IN_N, V4_IN_P

### Notes on the sheet
- (near R32) 4 X 100Ω
- (near R33) 4 X 100Ω
- Title
- Date
- Project
- Rev
- Engineer
- Sheet
- of

### Library data of the parts
C14 = RSC0007: ceramic X7R SMD capacitor smd 0603 47nF 16V; Manufacturer: Multicomp; Manufacturer Number: MC0603B473K160CT; Dealer number: 1759011; Dealer: Farnell; Tolerance: 10%; Part Number: RSC0007; Category: capacitors; Price: 0.009; Value: 47nF; Voltage: 16V; Case: 0603; Technology: SMT; Dielectric: X7R; HelpURL: U:\datasheet\cap\MULTICOMP_2.pdf; Supplier 1: Farnell; Supplier Part Number 1: 1759011
F1 = XXF0001: Polyfuse 250 mA holding current, 500 mA trip current; Manufacturer: Littelfuse; Manufacturer Number: 1206L025YR / 2920L030DR; Dealer number: 1596990; Dealer: Farnell; Trip current: 500mA; Max voltage: 16V; Resistance: 2.3Ω; Part Number: XXF0001; Category: Fuses; Price: 0.46; Type: Poly fuse; Holing current: 250mA; Technology: SMT; HelpURL: U:\datasheet\fuses\litefuse1.pdf; Supplier 1: Farnell; Supplier part number 1: 1596990
J1 = CHI0002: Harting IDC connector 2X17; Manufacturer Number: 09 18 534 7323; Pitch: 2.54mm; Lenght: 2.9mm; Strain Reliefe: no; Part Number: CHI0002; Category: Connectors; Price: 2.26; Manufacturer: Harting; Pins: 34; Orientation: right angle; Technology: THT; Supplier part number 1: 1106736; Supplier 1: Farnell
J2 = XCU0003: CONNECTOR, MICRO USB B, SMD, 5WAY; Manufacturer: FCI; Manufacturer Number: 10104111-0001LF; Gender: Receptacle; Part Number: XCU0003; Category: Connectors; Price: 0.37; Type: A; Size: micro; Technology: SMT / SMT; HelpURL: U:\datasheet\usb_con\FCI2_micro.pdf; Supplier part number 1: 2293755; Supplier 1: Farnell
R32-R39 R60 = XRS0016: as R27 on sheet Analog; Part Number: XRS0016; Category: resistors; Price: 0.009€; Value: 100Ω; Power: 0.1W; Tolerance: 5%; Case: 0603; Technology: SMT; Material: Metal film / Metal film; HelpURL: U:\datasheet\res\MULTICOMP 0603.pdf; Supplier part number 1: 2073352; Supplier 1: Farnell
R40 R41 = XRS0033: resistor smd 0603 27Ω 5% 0.1w; Manufacturer: Panasonic; Manufacturer Number: ERJ3GEYJ270V; Temperature coefficient: 200ppm; Part Number: XRS0033; Category: resistors; Price: 0.009€; Value: 27Ω; Power: 0.1W; Tolerance: 5%; Case: 0603; Technology: SMT; Material: Metal film - thick / Metal film - thick; HelpURL: U:\datasheet\res\PANASONIC.pdf; Supplier part number 1: 2059559; Supplier 1: Farnell
R42 = XRS0035: resistor smd 0603 1MΩ 5% 0.1w; Manufacturer: Multicomp; Manufacturer Number: MCMR06X105 JTL; Temperature coefficient: 100ppm; Part Number: XRS0035; Category: resistors; Price: 0.009€; Value: 1MΩ; Power: 0.1W; Tolerance: 5%; Case: 0603; Technology: SMT; Material: Metal film / Metal film; HelpURL: U:\datasheet\res\MULTICOMP 0603.pdf; SKU: 1000100000012; Supplier part number 1: 2073358; Supplier 1: Farnell
U5-U7 = XDE0000: ESD protection for high-speed interfaces; Manufacturer: Multicomp; Clamping voltage: 3.8V; Part Number: XDE0000; Category: diode array; Price: 0.174; Manufacturer Number: PUSB2X4Y; Case: SOT363; Technology: SMT; HelpURL: U:\datasheet\diodes_esd\PUSB2X4Y.pdf; Supplier part number 1: 2400968; Supplier 1: Farnell

## Sheet Power_suply.SchDoc: Power suply
size A4; Date: 6.4.2015; Engineer: Matjaz Tome; DocumentNumber: 4; Revision: B1; SheetNumber: 4; SheetTotal: 8; Project: USB DAQ
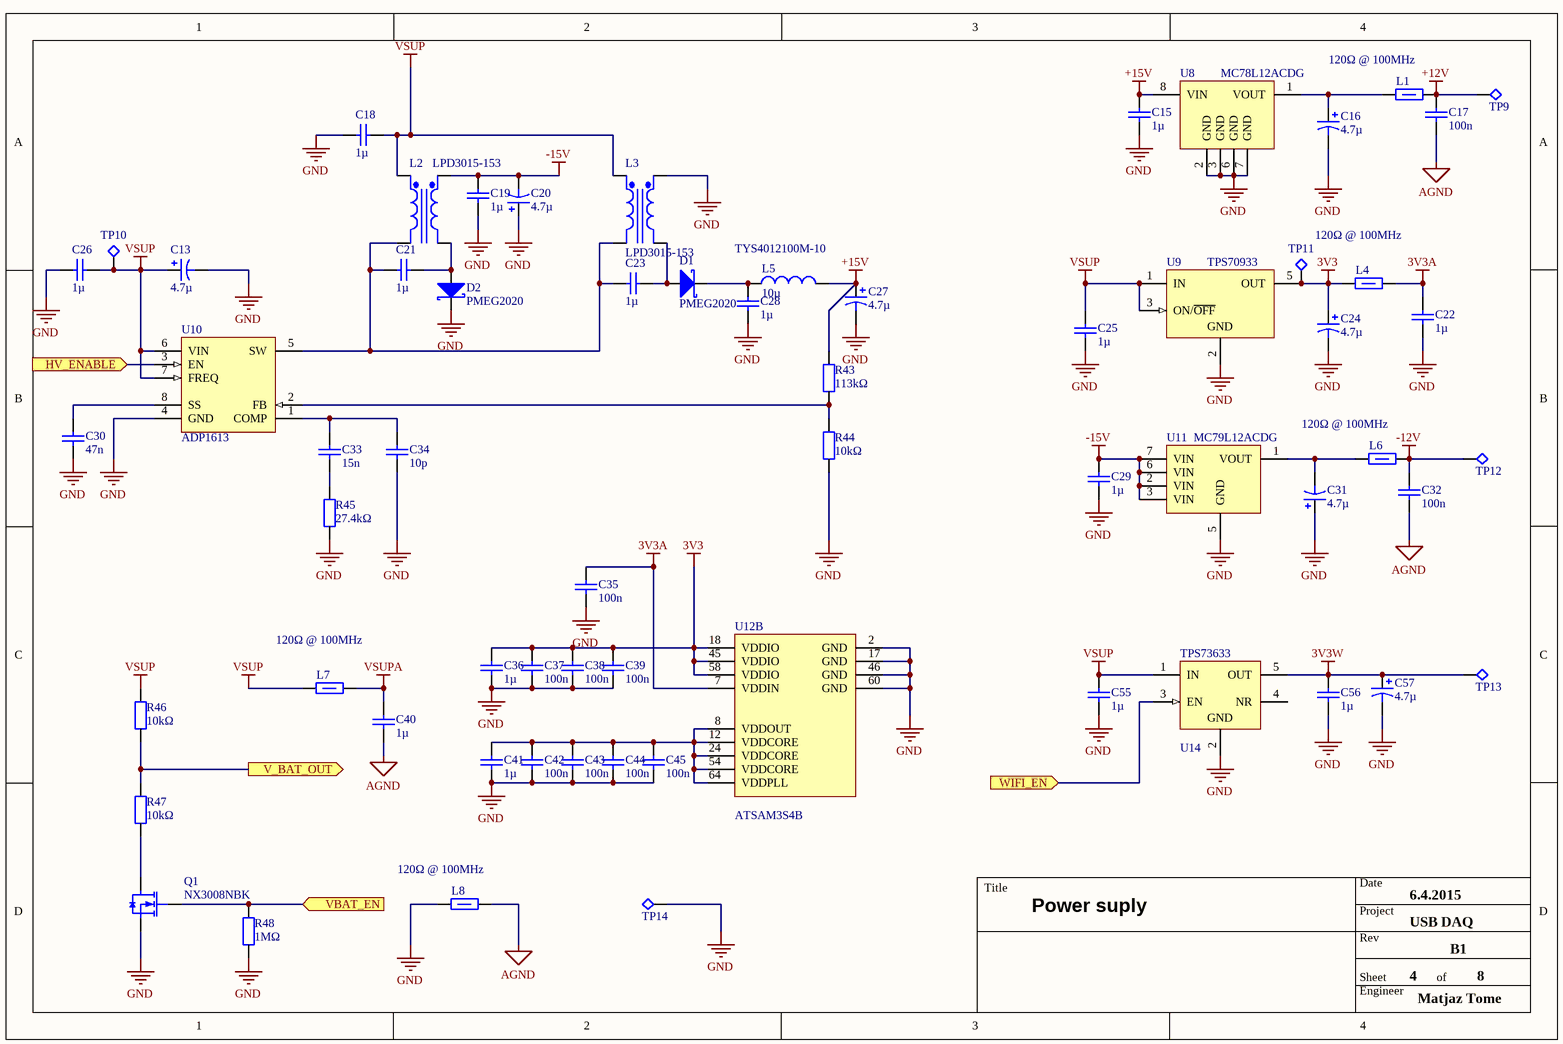
[diagram p4: Power_suply.SchDoc]

### Parts
C13  4.7µ  [A]
C15  1µ  [0603C]
C16  4.7µ  [A]
C17  100n  [0603C]
C18  1µ  [0603C]
C19  1µ  [0603C]
C20  4.7µ  [A]
C21  1µ  [0603C]
C22  1µ  [0603C]
C23  1µ  [0603C]
C24  4.7µ  [A]
C25  1µ  [0603C]
C26  1µ  [0603C]
C27  4.7µ  [A]
C28  1µ  [0603C]
C29  1µ  [0603C]
C30  47n  [0603C]
C31  4.7µ  [A]
C32  100n  [0603C]
C33  15n  [0603C]
C34  10p  [0603C]
C35  100n  [0603C]
C36  1µ  [0603C]
C37  100n  [0603C]
C38  100n  [0603C]
C39  100n  [0603C]
C40  1µ  [0603C]
C41  1µ  [0603C]
C42  100n  [0603C]
C43  100n  [0603C]
C44  100n  [0603C]
C45  100n  [0603C]
C55  1µ  [0603C]
C56  1µ  [0603C]
C57  4.7µ  [A]
D1  PMEG2020  [SOD323]
D2  PMEG2020  [SOD323]
L1  120Ω @ 100MHz  [0805R]
L2  LPD3015-153  [LPD3015]
L3  LPD3015-153  [LPD3015]
L4  120Ω @ 100MHz  [0805R]
L5  10µ  Manufacturer Number: TYS4012100M-10  [ind_4mmX4mm]
L6  120Ω @ 100MHz  [0805R]
L7  120Ω @ 100MHz  [0805R]
L8  120Ω @ 100MHz  [0805R]
Q1  NX3008NBK  [SOT23-3]
R43  113kΩ  [0603R]
R44  10kΩ  [0603R]
R45  27.4kΩ  [0603R]
R46  10kΩ  [0603R]
R47  10kΩ  [0603R]
R48  1MΩ  [0603R]
TP9  testpoint  [TP1_FULL]  (value not drawn)  (no BOM)
TP10  testpoint  [TP1_FULL]  (value not drawn)  (no BOM)
TP11  testpoint  [TP1_FULL]  (value not drawn)  (no BOM)
TP12  testpoint  [TP1_FULL]  (value not drawn)  (no BOM)
TP13  testpoint  [TP1_FULL]  (value not drawn)  (no BOM)
TP14  testpoint  [TP1_FULL]  (value not drawn)  (no BOM)
U8  MC78L12ACDG  [SOIC8]
U9  TPS70933  [SOT23-5]
U10  ADP1613  [MSOP8]
U11  MC79L12ACDG  [SOIC8]
U12  ATSAM3S4B  [LQFP64]  (part B of 2)
U14  TPS73633  [SOT23-5]

### Ports
HV_ENABLE (in), V_BAT_OUT (out), VBAT_EN (in), WIFI_EN (in)

### Nets
3V3: C24.1 C36.2 C37.1 C38.1 C39.1 L4.1 TP11.1 U9.5(OUT) U12.18(VDDIO) U12.45(VDDIO) U12.58(VDDIO)
3V3A: C22.2 C35.1 L4.2 U12.7(VDDIN)
3V3W: C56.2 C57.1 TP13.1 U14.5(OUT)
+12V: C17.1 L1.2 TP9.1
+15V: C15.2 C27.1 L5.2 R43.2 U8.8(VIN)
-12V: C32.1 L6.2 TP12.1
-15V: C19.2 C20.2 C29.2 L2.1 U11.2(VIN) U11.3(VIN) U11.6(VIN) U11.7(VIN)
AGND: C17.2 C32.2 C40.1 L8.2
GND: C13.2 C15.1 C16.2 C18.2 C19.1 C20.1 C22.1 C24.2 C25.1 C26.1 C27.2 C28.1 C29.1 C30.1 C31.1 C34.1 C35.2 C36.1 C37.2 C38.2 C39.2 C41.1 C42.2 C43.2 C44.2 C45.2 C55.1 C56.1 C57.2 D2.2(K) L3.4 L8.1 Q1.2(S) R44.1 R45.1 R48.1 TP14.1 U8.2(GND) U8.3(GND) U8.6(GND) U8.7(GND) U9.2(GND) U10.4(GND) U11.5(GND) U12.2(GND) U12.17(GND) U12.46(GND) U12.60(GND) U14.2(GND)
VSUP: C13.1 C18.1 C25.2 C26.2 C55.2 L2.4 L3.1 L7.1 R46.2 TP10.1 U9.1(IN) U9.3(ON/~{OFF}) U10.6(VIN) U10.7(FREQ) U14.1(IN)
VSUPA: C40.2 L7.2
HV_ENABLE: U10.3(EN) ; port HV_ENABLE
V_BAT_IN: R46.1 R47.2 ; port V_BAT_OUT
VBAT_EN: Q1.1(G) R48.2 ; port VBAT_EN
WIFI_EN: U14.3(EN) ; port WIFI_EN
NetC16_1: C16.1 L1.1 U8.1(VOUT)
NetC21_1: C21.1 D2.1(A) L2.2
NetC21_2: C21.2 C23.2 L2.3 L3.2 U10.5(SW)
NetC23_1: C23.1 D1.1(A) L3.3
NetC28_2: C28.2 D1.2(K) L5.1
NetC30_2: C30.2 U10.8(SS)
NetC31_2: C31.2 L6.1 U11.1(VOUT)
NetC33_1: C33.1 R45.2
NetC33_2: C33.2 C34.2 U10.1(COMP)
NetC41_2: C41.2 C42.1 C43.1 C44.1 C45.1 U12.8(VDDOUT) U12.12(VDDCORE) U12.24(VDDCORE) U12.54(VDDCORE) U12.64(VDDPLL)
NetQ1_3: Q1.3(D) R47.1
NetR43_1: R43.1 R44.2 U10.2(FB)

Not connected (* = marked no-connect by the designer): U14 4(NR)

### Notes on the sheet
- Title
- Date
- Project
- Rev
- Engineer
- Sheet
- of

### Library data of the parts
C13 C16 C20 C24 C27 C31 C57 = CST0011: tantalum SMD capacitor 4.7µF 16V A case; Manufacturer: Kemet; Manufacturer Number: T491A475M016AT; ESR: 4Ω; Tolerance: 10%; Part Number: CST0011; Category: Capacitors; Supplier part number 1: 2462769; Supplier 1: Farnell; Price: 0.20; Value: 4.7µF; Voltage: 16V; Case: A; Technology: SMT; Dielectric: Tantalum; HelpURL: U:\datasheet\cap\KEMET TANT SMD.pdf
C15 C18 C19 C21-C23 C25 C26 C28 C29 C36 C40 C41 C55 C56 = ZSC0003: as C48 on sheet Processor; Part Number: ZSC0003; Category: capacitors; Price: 0.144; Value: 1µF; Voltage: 50V; Case: 0603; Technology: SMT; Dielectric: X5R; HelpURL: U:\datasheet\cap\Murata\GRM\GRM188R61H105KAALD.pdf; SKU: 1020300000001; Supplier part number 1: 1845736; Supplier 1: Farnell
C17 C32 C35 C37-C39 C42-C45 = RSC0013: as C1 on sheet Analog; Part Number: RSC0013; Category: capacitors; Price: 0.042; Value: 100nF; Voltage: 16V; Case: 0603; Technology: SMT; Dielectric: X7R; HelpURL: U:\datasheet\cap\Murata\GRM\GRM188R71C104KA01D.pdf; Supplier 1: Farnell; Supplier Part Number 1: 1828890
C30 = RSC0007: as C14 on sheet IO; Part Number: RSC0007; Category: capacitors; Price: 0.009; Value: 47nF; Voltage: 16V; Case: 0603; Technology: SMT; Dielectric: X7R; HelpURL: U:\datasheet\cap\MULTICOMP_2.pdf; Supplier 1: Farnell; Supplier Part Number 1: 1759011
C33 = RSC0015: ceramic X7R SMD capacitor smd 0603 15nF 100V; Manufacturer: Kemet; Manufacturer Number: C0603C153K1RACTU; Dealer number: 1865546; Dealer: Farnell; Tolerance: 10%; Part Number: RSC0015; Category: capacitors; Price: 0.019; Value: 15nF; Voltage: 100V; Case: 0603; Technology: SMT; Dielectric: X7R; HelpURL: U:\datasheet\cap\KEMET X7R SMD.pdf; SKU: 1020100000009; Supplier 1: Farnell; Supplier Part Number 1: 1865546
C34 = GSC0019: as C49 on sheet Processor; Part Number: GSC0019; Category: capacitors; Price: 0.038; Value: 10pF; Voltage: 100V; Case: 0603; Technology: SMT; Dielectric: C0G; HelpURL: U:\datasheet\cap\KEMET C0G SMD.pdf; SKU: 1020000000004; Supplier 1: Farnell; Supplier part number 1: 1414600
D1 D2 = XDS0004: Shotkey diode 2A 20V; Manufacturer: Infineon; Manufacturer Number: PMEG2020AEA; Part Number: XDS0004; Category: diodes; Price: 0.126; Max  Reverse Voltage: 20V; Max current: 2A; Case: SOD323; Technology: SMT; HelpURL: U:\datasheet\shotkey\PMEG2020.pdf; Supplier part number 1: 8737940; Supplier 1: Farnell
L1 L4 L6-L8 = XFB0000: as L9 on sheet Processor; Part Number: XFB0000; Category: ferite beads; Price: 0.082; DC resistance: 0.15Ω; AC resistance: 120Ω; Frequency: 100MHz; Case: 0805; Technology: SMT; HelpURL: U:\datasheet\ferrite_beads\BLM21A.pdf; Supplier 1: Farnell; Supplier part number 1: 1515617
L2 L3 = XCI0000: Coupled Inductors; Manufacturer: Coilcraft; Manufacturer Number: LPD3015-153MRB; Value: 15µH; Current RMS: 460mA; Current Satturation: 500mA; Resistance: 1.42Ω; Tolerance: 20%; Part Number: XCI0000; Category: Inductors; Price: 0.82; Case: LPD3015; Technology: SMT; HelpURL: U:\datasheet\inductors_coupled\LPD3015.pdf; Supplier part number 1: 2407927; Supplier 1: Farnell
L5 = XXI0000: SMD inductor 10µH, 0.8A; Manufacturer: Laird Technologies; Type: Power; Dealer number: 2292514; Dealer: Farnell; Current RMS: 770mA; Current Satturation: 800mA; Resistance: 0.265Ω; Tolerance: 20%; Part Number: XXI0000; Category: Inductors; Price: 0.26; Value: 10µH; Case: 4mm X 4mm; Technology: SMT; HelpURL: U:\datasheet\inductors_smd\power\TYS4012100M-10.pdf; Supplier 1: Farnell; Supplier Part Number 1: 2292514
Q1 = XMN0003: 30V 0.4A N-mosfet; Manufacturer: NXP; RDS: 1Ω; Max power disipation: 350mW; Type: N-enhancment mode; Logic level: Yes; Part Number: XMN0003; Category: mosfets; Supplier part number 1: 2069541; Supplier 1: Farnell; Price: 0.053; Manufacturer Number: NX3008NBK; Max voltage: 30V; Max current: 0.4A; Case: SOT23-3; Technology: SMT; HelpURL: U:\datasheet\nmos\NX3008NBK.pdf
R43 = YRS0021: resistor smd 0603 113kΩ 1% 0.1w; Manufacturer: Vishay; Manufacturer Number: CRCW0603113KFKEA; Dealer number: 2138502; Dealer: Farnell; Temperature coefficient: 100ppm; Part Number: YRS0021; Category: resistors; Price: 0.007€; Value: 113kΩ; Power: 0.1W; Tolerance: 1%; Case: 0603; Technology: SMT; Material: Metal film - thick / Metal film; HelpURL: U:\datasheet\res\VISHAY CRCW0603.pdf; SKU: 1000000000004; Supplier 1: Farnell; Supplier part number 1: 2138502
R44 R46 R47 = YRS0016: as R51 on sheet Processor; Part Number: YRS0016; Category: resistors; Price: 0.0143€; Value: 10kΩ; Power: 0.1W; Tolerance: 1%; Case: 0603; Technology: SMT; Material: Metal film - thick / Metal film; HelpURL: U:\datasheet\res\VISHAY CRCW0603.pdf; SKU: 1000000000002; Supplier 1: Farnell; Supplier part number 1: 1469748
R45 = YRS0020: resistor smd 0603 27.4kΩ 1% 0.1w; Manufacturer: Vishay; Manufacturer Number: CRCW060327K4FKEA; Dealer number: 1652865; Dealer: Farnell; Temperature coefficient: 100ppm; Part Number: YRS0020; Category: resistors; Price: 0.084€; Value: 27.4kΩ; Power: 0.1W; Tolerance: 1%; Case: 0603; Technology: SMT; Material: Metal film - thick / Metal film; HelpURL: U:\datasheet\res\VISHAY CRCW0603.pdf; Supplier 1: Farnell; Supplier part number 1: 1652865
R48 = XRS0035: as R42 on sheet IO; Part Number: XRS0035; Category: resistors; Price: 0.009€; Value: 1MΩ; Power: 0.1W; Tolerance: 5%; Case: 0603; Technology: SMT; Material: Metal film / Metal film; HelpURL: U:\datasheet\res\MULTICOMP 0603.pdf; SKU: 1000100000012; Supplier part number 1: 2073358; Supplier 1: Farnell
TP9-TP14 = XXC0006: testpoint 1.5mm diameter no hole; Part Number: XXC0006; Category: testpoints
U8 = XLR0006: 100 mA Positive Voltage / Regulator; Manufacturer: ON Semiconductors; Output Voltage: 12V; Max input voltage: 35V; Output current: 100mA; Voltage tolerance: 5%; Teperature range: 0°C to +150°C; LDO: No; Part Number: XLR0006; Category: Integrated circuits; Price: 0.43; Manufacturer Number: MC78L12ACDG; Low noise: No; Case: SOIC8; Technology: SMT; HelpURL: U:\datasheet\linear_reg\MC78LXX.pdf; Supplier part number 1: 9666273; Supplier 1: Farnell
U9 = XLR0012: 1-µA IQ Voltage Regulators with Enable; Manufacturer: Texas Instruments; Manufacturer Number: TPS70933DBVT; Output Voltage: 3.3V; Max input voltage: 30V; Output current: 150mA; Teperature range: -40°C to +85°C; LDO: Yes; Low noise: No; Part Number: XLR0012; Category: Integrated circuits; Price: 0.86; Case: SOT23-5; Technology: SMT; HelpURL: U:\datasheet\linear_reg\TPS709xx.pdf; Supplier part number 1: 2382995; Supplier 1: Farnell
U10 = XSW0008: 650 kHz /1.3 MHz Step-Up PWM DC-to-DC Switching Converters / REGULATORS / Synchronous Step-Down DC-DC Converter; Manufacturer: Analog devices; Manufacturer Number: ADP1613ARMZ-R7; Dealer number: 2102527; Dealer: Farnell; Switching element: Internal; Synchronious: No; Input voltage max: 5.5V; Input voltage min: 2.5V; Output voltage max: 20V; Output voltage min: 3.6V; Max output current: 1.5A; Part Number: XSW0008; Category: Integrated circuits; Price: 1.63; Type: Boost; Case: MSOP8; Multyphaze: No; Ext Cock: No; Technology: SMT; HelpURL: U:\datasheet\switchers\ADP161X.pdf; Supplier 1: Farnell; Supplier part number 1: 2102527
U11 = XLR0007: 100 mA Negative Voltage / Regulator; Manufacturer: ON Semiconductors; Output Voltage: -12V; Max input voltage: -14V; Output current: 100mA; Voltage tolerance: 5%; Teperature range: 0°C to +150°C; LDO: No; Part Number: XLR0007; Category: Integrated circuits; Price: 0.52; Manufacturer Number: MC79L12ACDG; Low noise: No; Case: SOIC8; Technology: SMT; HelpURL: U:\datasheet\linear_reg\MC79LXX.pdf; Supplier part number 1: 1652361; Supplier 1: Farnell
U12 = XAM0003: as U12 on sheet Processor; Part Number: XAM0003; Category: Integrated circuits; Price: 6.58; UART: 3; Case: LQFP64; Technology: SMT; HelpURL: U:\datasheet\microcontrollers\arm\SAM3SXA.pdf; Temperature range: -40°C to +85°C; Supplier 1: Farnell; Supplier part number 1: 1841656
U14 = XLR0013: Cap-Free, NMOS, 400-mA Low-Dropout Regulator with Reverse Current Protection; Manufacturer: Texas instruments; Manufacturer Number: TPS73633DBV; Output Voltage: 3.3V; Max input voltage: 5.5V; Output current: 400mA; Voltage tolerance: 1%; Teperature range: -40°C to +125°C; LDO: Yes; Low noise: No; Part Number: XLR0013; Category: Integrated circuits; Price: 2.53; Case: SOT23-5; Technology: SMT; HelpURL: U:\datasheet\linear_reg\TPS736.pdf; Supplier part number 1: 1207346; Supplier 1: Farnell

## Sheet Battery_manegment.SchDoc: Battery managment
size A4; Date: 11.11.2015; Engineer: Matjaz Tome; DocumentNumber: 3; Revision: B1; SheetNumber: 3; SheetTotal: 8; Project: USB DAQ
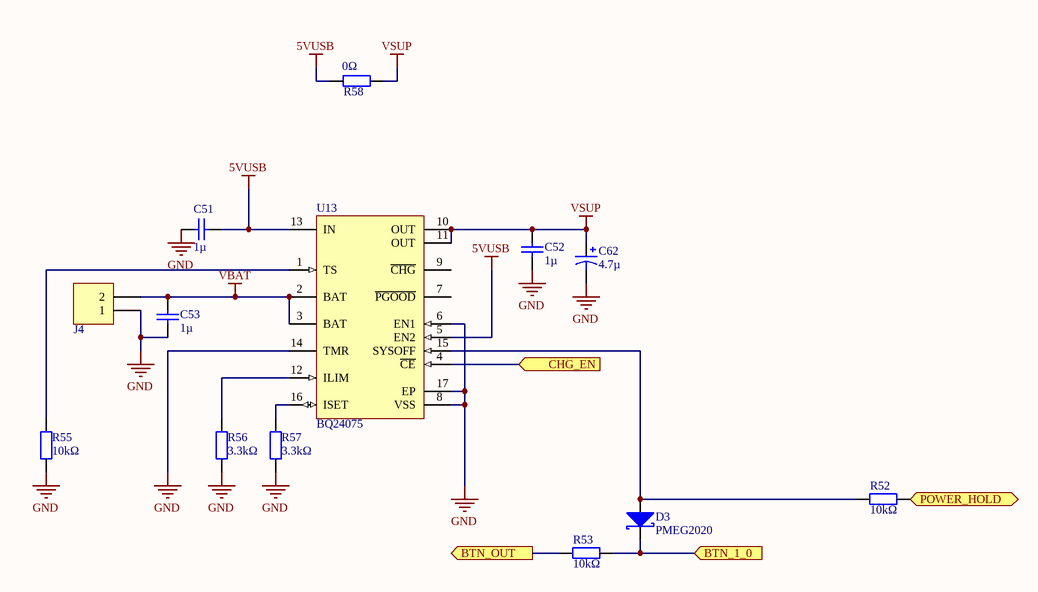
[diagram p5: Battery_manegment.SchDoc]

### Parts
C51  1µ  [0603C]
C52  1µ  [0603C]
C53  1µ  [0603C]
C62  4.7µ  [A]
D3  PMEG2020  [SOD323]
J4  B2B-PH-K-S(LF)(SN)  [JST_PH_2_V]  (value not drawn)
R52  10kΩ  [0603R]
R53  10kΩ  [0603R]
R55  10kΩ  [0603R]
R56  3.3kΩ  [0603R]
R57  3.3kΩ  [0603R]
R58  0Ω  [0603R]
U13  BQ24075  [QFN16_PAD]

### Ports
BTN_1_0 (in), BTN_OUT (out), CHG_EN (in), POWER_HOLD (in)

### Nets
5VUSB: C51.2 R58.1 U13.5(EN2) U13.13(IN)
GND: C51.1 C52.1 C53.1 C62.2 J4.1 R55.1 R56.1 R57.1 U13.6(EN1) U13.8(VSS) U13.14(TMR) U13.17(EP)
VBAT: C53.2 J4.2 U13.2(BAT) U13.3(BAT)
VSUP: C52.2 C62.1 R58.2 U13.10(OUT) U13.11(OUT)
BTN_0: D3.2(K) R53.1 ; port BTN_1_0
BTN_IN: R53.2 ; port BTN_OUT
CHG_EN: U13.4(~{CE}) ; port CHG_EN
POWER_HOLD: R52.1 ; port POWER_HOLD
NetD3_1: D3.1(A) R52.2 U13.15(SYSOFF)
NetR55_2: R55.2 U13.1(TS)
NetR56_2: R56.2 U13.12(ILIM)
NetR57_2: R57.2 U13.16(ISET)

Not connected (* = marked no-connect by the designer): U13 7(~{PGOOD}) 9(~{CHG})

### Notes on the sheet
- Title
- Date
- Project
- Rev
- Engineer
- Sheet
- of

### Library data of the parts
C51-C53 = ZSC0003: as C48 on sheet Processor; Part Number: ZSC0003; Category: capacitors; Price: 0.144; Value: 1µF; Voltage: 50V; Case: 0603; Technology: SMT; Dielectric: X5R; HelpURL: U:\datasheet\cap\Murata\GRM\GRM188R61H105KAALD.pdf; SKU: 1020300000001; Supplier part number 1: 1845736; Supplier 1: Farnell
C62 = CST0011: as C13 on sheet Power_suply; Part Number: CST0011; Category: Capacitors; Supplier part number 1: 2462769; Supplier 1: Farnell; Price: 0.20; Value: 4.7µF; Voltage: 16V; Case: A; Technology: SMT; Dielectric: Tantalum; HelpURL: U:\datasheet\cap\KEMET TANT SMD.pdf
D3 = XDS0004: as D1 on sheet Power_suply; Part Number: XDS0004; Category: diodes; Price: 0.126; Max  Reverse Voltage: 20V; Max current: 2A; Case: SOD323; Technology: SMT; HelpURL: U:\datasheet\shotkey\PMEG2020.pdf; Supplier part number 1: 8737940; Supplier 1: Farnell
J4 = CJP0005: JST PH connector 2 poles vertical; Gender: male; Rows: 1; Pitch: 2mm; Lenght: 6mm; Part Number: CJP0005; Category: Connectors; Price: 0.116; Manufacturer: JST; Manufacturer Number: B2B-PH-K-S(LF)(SN); Pins: 2; Orientation: horizontal; Technology: THT; HelpURL: U:\datasheet\connectors_JST\JST_PH.pdf; Supplier part number 1: 9491856; Supplier 1: Farnell
R52 R53 R55 = YRS0016: as R51 on sheet Processor; Part Number: YRS0016; Category: resistors; Price: 0.0143€; Value: 10kΩ; Power: 0.1W; Tolerance: 1%; Case: 0603; Technology: SMT; Material: Metal film - thick / Metal film; HelpURL: U:\datasheet\res\VISHAY CRCW0603.pdf; SKU: 1000000000002; Supplier 1: Farnell; Supplier part number 1: 1469748
R56 R57 = XRS0055: as R49 on sheet Processor; Part Number: XRS0055; Category: resistors; Supplier part number 1: 9233440; Supplier 1: Farnell; Price: 0.0118; Value: 3.3kΩ; Power: 0.1W; Tolerance: 5%; Case: 0603; Technology: SMT; Material: Metal film / Metal film; HelpURL: U:\datasheet\res\YAGEO_2.pdf
R58 = XRS0022: resistor smd 0603 0Ω 5% 0.1w; Manufacturer: Panasonic; Manufacturer Number: ERJ3GEY0R00V; Temperature coefficient: 100ppm; Part Number: XRS0022; Category: resistors; Price: 0.009€; Value: 0Ω; Power: 0.1W; Tolerance: 5%; Case: 0603; Technology: SMT; Material: Metal film / Metal film; HelpURL: U:\datasheet\res\PANASONIC.pdf; Supplier part number 1: 2059527; Supplier 1: Farnell
U13 = BAC0000: 1.5-A USB-Friendly Li-Ion Battery Charger and Power-Path Management IC; Manufacturer: Texas Instruments; Manufacturer Number: BQ24075RGTT; Dealer number: 1754755; Dealer: Farnell; Part Number: BAC0000; Category: Integrated circuits; Price: 2.67; Technology: SMT; HelpURL: U:\datasheet\battery_chargers\bq2407x.pdf; Supplier 1: Farnell; Supplier part number 1: 1754755

## Sheet WIFI_Display.SchDoc: WIFI, Display, Encoder
size A4; Date: 18.12.2015; Engineer: Matjaz Tome; DocumentNumber: 7; Revision: B1; SheetNumber: 7; SheetTotal: 8; Project: USB DAQ
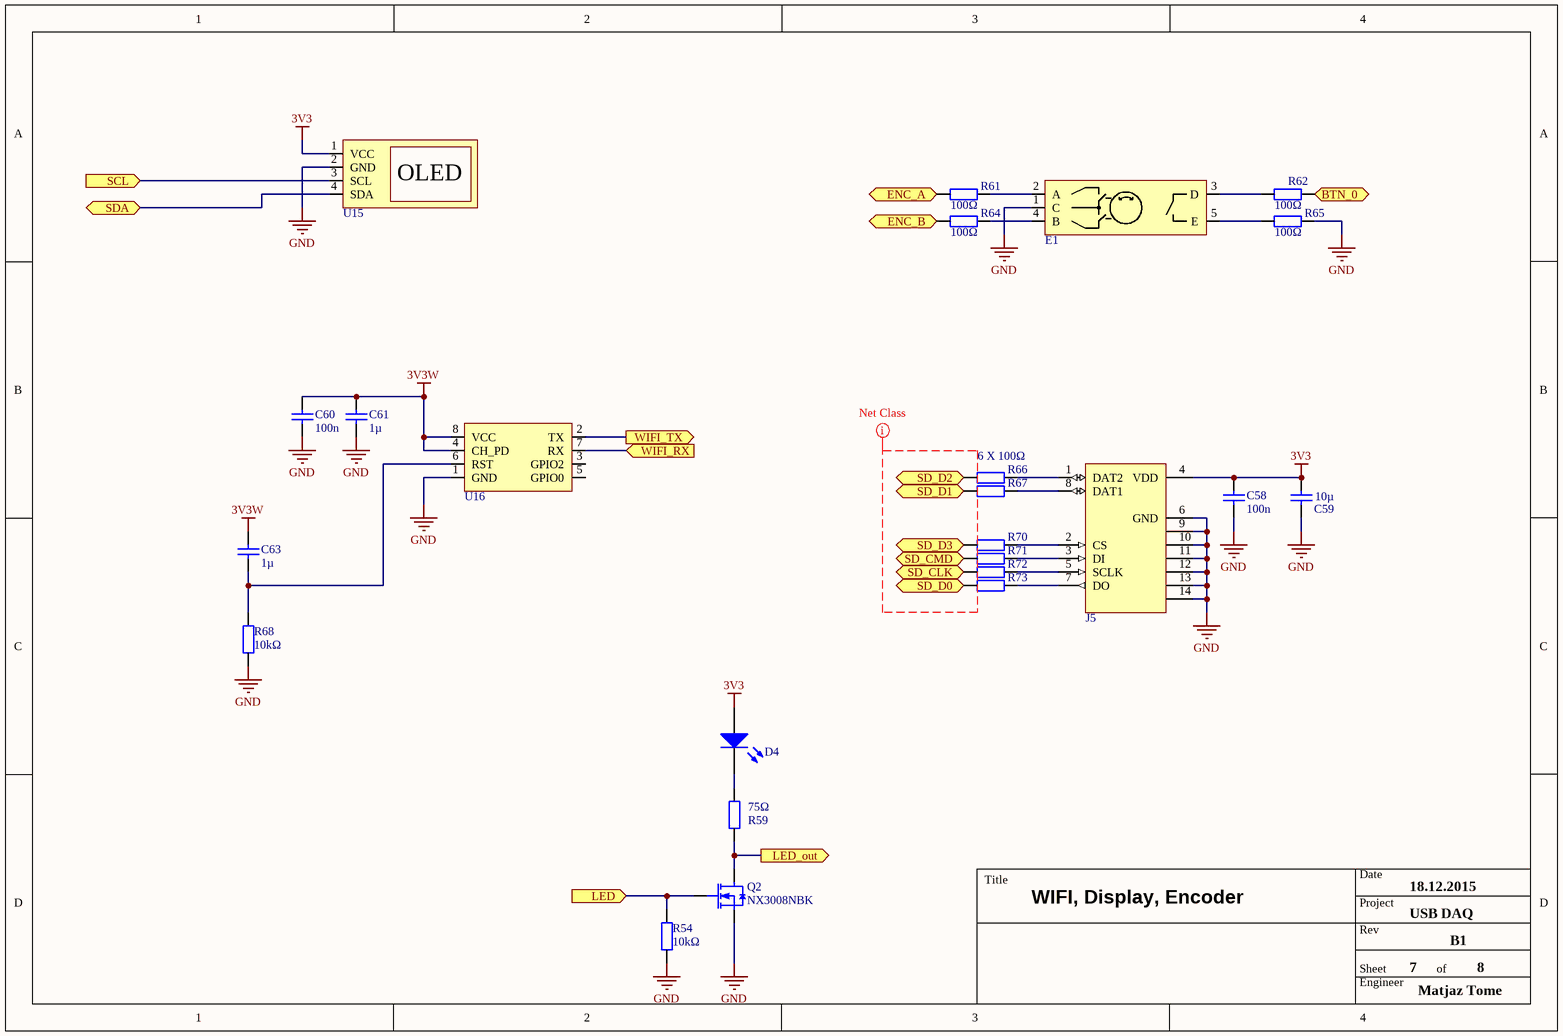
[diagram p6: WIFI_Display.SchDoc]

### Parts
C58  100n  [0603C]
C59  10µ  [0805C]
C60  100n  [0603C]
C61  1µ  [0603C]
C63  1µ  [0603C]
D4  KPT-2012SGC  [LED0805]  (value not drawn)
E1  EC12D  [EC12D]  (value not drawn)
J5  SD card  [MICRO_SD_AMPHENOL]  (value not drawn)
Q2  NX3008NBK  [SOT23-3]
R54  10kΩ  [0603R]
R59  75Ω  [0603R]
R61  100Ω  [0603R]
R62  100Ω  [0603R]
R64  100Ω  [0603R]
R65  100Ω  [0603R]
R66  100Ω  [0603R]  (value not drawn)
R67  100Ω  [0603R]  (value not drawn)
R68  10kΩ  [0603R]
R70  100Ω  [0603R]  (value not drawn)
R71  100Ω  [0603R]  (value not drawn)
R72  100Ω  [0603R]  (value not drawn)
R73  100Ω  [0603R]  (value not drawn)
U15  SSD1306  [OLED1]  (value not drawn)
U16  ESP-01  [ESP-01]  (value not drawn)

### Ports
BTN_0 (out), ENC_A (out), ENC_B (out), LED (in), LED_out (out), SCL (in), SD_CLK (in), SD_CMD (in), SD_D0 (bidir), SD_D1 (bidir), SD_D2 (bidir), SD_D3 (bidir), SDA (bidir), WIFI_RX (in), WIFI_TX (out)

### Nets
3V3: C58.1 C59.2 D4.A J5.4(VDD) U15.1(VCC)
3V3W: C60.1 C61.2 C63.2 U16.4(CH_PD) U16.8(VCC)
GND: C58.2 C59.1 C60.2 C61.1 E1.1(C) J5.6(GND) J5.9 J5.10 J5.11 J5.12 J5.13 J5.14 Q2.2(S) R54.1 R65.2 R68.1 U15.2(GND) U16.1(GND)
BTN_0: R62.2 ; port BTN_0
ENC_A: R61.1 ; port ENC_A
ENC_B: R64.1 ; port ENC_B
JTAG_TDO: Q2.1(G) R54.2 ; port LED
LED_in: Q2.3(D) R59.1 ; port LED_out
SCL: U15.3(SCL) ; port SCL
SD_CLK: R72.1 ; port SD_CLK
SD_CMD: R71.1 ; port SD_CMD
SD_D0: R73.1 ; port SD_D0
SD_D1: R67.1 ; port SD_D1
SD_D2: R66.1 ; port SD_D2
SD_D3: R70.1 ; port SD_D3
SDA: U15.4(SDA) ; port SDA
UART_0_RX: U16.2(TX) ; port WIFI_TX
UART_0_TX: U16.7(RX) ; port WIFI_RX
NetC63_1: C63.1 R68.2 U16.6(RST)
NetD4_K: D4.K R59.2
NetE1_2: E1.2(A) R61.2
NetE1_3: E1.3(D) R62.1
NetE1_4: E1.4(B) R64.2
NetE1_5: E1.5(E) R65.1
NetJ5_1: J5.1(DAT2) R66.2
NetJ5_2: J5.2(CS) R70.2
NetJ5_3: J5.3(DI) R71.2
NetJ5_5: J5.5(SCLK) R72.2
NetJ5_7: J5.7(DO) R73.2
NetJ5_8: J5.8(DAT1) R67.2

Not connected (* = marked no-connect by the designer): U16 3(GPIO2) 5(GPIO0)

### Layout directives
net class SD_CARD: (no net found under the mark)

### Notes on the sheet
- (near R66) 6 X 100Ω
- Title
- Date
- Project
- Rev
- Engineer
- Sheet
- of
- (in symbol OLM0000) OLED

### Library data of the parts
C58 C60 = RSC0013: as C1 on sheet Analog; Part Number: RSC0013; Category: capacitors; Price: 0.042; Value: 100nF; Voltage: 16V; Case: 0603; Technology: SMT; Dielectric: X7R; HelpURL: U:\datasheet\cap\Murata\GRM\GRM188R71C104KA01D.pdf; Supplier 1: Farnell; Supplier Part Number 1: 1828890
C59 = VSC0001: ceramic Y5V SMD capacitor smd 0805 10µF 6.3V; Manufacturer: Multicomp; Manufacturer Number: MC0805F106Z6R3CT; Tolerance: +80 -20%; Part Number: VSC0001; Category: capacitors; Price: 0.04; Value: 10µF; Voltage: 6.3V; Case: 0805; Technology: SMT; Dielectric: Y5V; HelpURL: U:\datasheet\cap\MULTICOMP_1.pdf; Supplier Part Number 1: 1759136; Supplier 1: Farnell
C61 C63 = ZSC0003: as C48 on sheet Processor; Part Number: ZSC0003; Category: capacitors; Price: 0.144; Value: 1µF; Voltage: 50V; Case: 0603; Technology: SMT; Dielectric: X5R; HelpURL: U:\datasheet\cap\Murata\GRM\GRM188R61H105KAALD.pdf; SKU: 1020300000001; Supplier part number 1: 1845736; Supplier 1: Farnell
D4 = XXL0000: Green led SMD 0805; Manufacturer: Kingbright; Dealer number: 2099239; Dealer: Farnell; If: 20mA; Uf: 2.2V; Luminous Intensity: 12mcd; Part Number: XXL0000; Category: Led; Price: 0.068; Manufacturer Number: KPT-2012SGC; Color: Green; Case: 0805; Technology: SMT; HelpURL: U:\datasheet\led\KPT-2012SGC.pdf; SKU: 5500000000000; Supplier 1: Farnell; Supplier part number 1: 2099239
E1 = XRE0000: Rotary encoder with push button; Manufacturer: Alps; Manufacturer Number: EC12D1564402; Part Number: XRE0000; Category: Rotary encoders; Price: 0.89; Technology: THT; HelpURL: U:\datasheet\rotary_encoders\ec12.pdf; Supplier part number 1: 2065075; Supplier 1: Farnell
J5 = XMC0000: Micro SD card connector; Manufacturer: Amphenol; Manufacturer Number: 114-00841-68; Part Number: XMC0000; Category: connectors; Price: 2.17; Card type: Micro SD; Technology: SMT; HelpURL: U:\datasheet\memory_cards\amphenol_micro_sd.pdf; Supplier part number 1: 2293708; Supplier 1: Farnell
Q2 = XMN0003: as Q1 on sheet Power_suply; Part Number: XMN0003; Category: mosfets; Supplier part number 1: 2069541; Supplier 1: Farnell; Price: 0.053; Manufacturer Number: NX3008NBK; Max voltage: 30V; Max current: 0.4A; Case: SOT23-3; Technology: SMT; HelpURL: U:\datasheet\nmos\NX3008NBK.pdf
R54 R68 = YRS0016: as R51 on sheet Processor; Part Number: YRS0016; Category: resistors; Price: 0.0143€; Value: 10kΩ; Power: 0.1W; Tolerance: 1%; Case: 0603; Technology: SMT; Material: Metal film - thick / Metal film; HelpURL: U:\datasheet\res\VISHAY CRCW0603.pdf; SKU: 1000000000002; Supplier 1: Farnell; Supplier part number 1: 1469748
R59 = XRS0024: resistor smd 0603 75Ω 5% 0.1w; Manufacturer: Multicomp; Manufacturer Number: MCMR06X750 JTL; Temperature coefficient: 100ppm; Part Number: XRS0024; Category: resistors; Price: 0.008€; Value: 75Ω; Power: 0.1W; Tolerance: 5%; Case: 0603; Technology: SMT; Material: Metal film / Metal film; HelpURL: U:\datasheet\res\MULTICOMP 0603.pdf; Supplier part number 1: 2073569; Supplier 1: Farnell
R61 R62 R64-R67 R70-R73 = XRS0016: as R27 on sheet Analog; Part Number: XRS0016; Category: resistors; Price: 0.009€; Value: 100Ω; Power: 0.1W; Tolerance: 5%; Case: 0603; Technology: SMT; Material: Metal film / Metal film; HelpURL: U:\datasheet\res\MULTICOMP 0603.pdf; Supplier part number 1: 2073352; Supplier 1: Farnell
U15 = OLM0000: Oled display module; Dealer: Ebay; Part Number: OLM0000; Category: Displays; Price: 7; Technology: THT; HelpURL: U:\datasheet\Oled_modules\SSD1306.pdf
U16 = XWM0000: WIFI module; Dealer: Ebay; Part Number: XWM0000; Category: WIFI modules; Price: 3.8; Technology: THT